# EAGLE design ph_v6 (EAGLE 6.5.0)
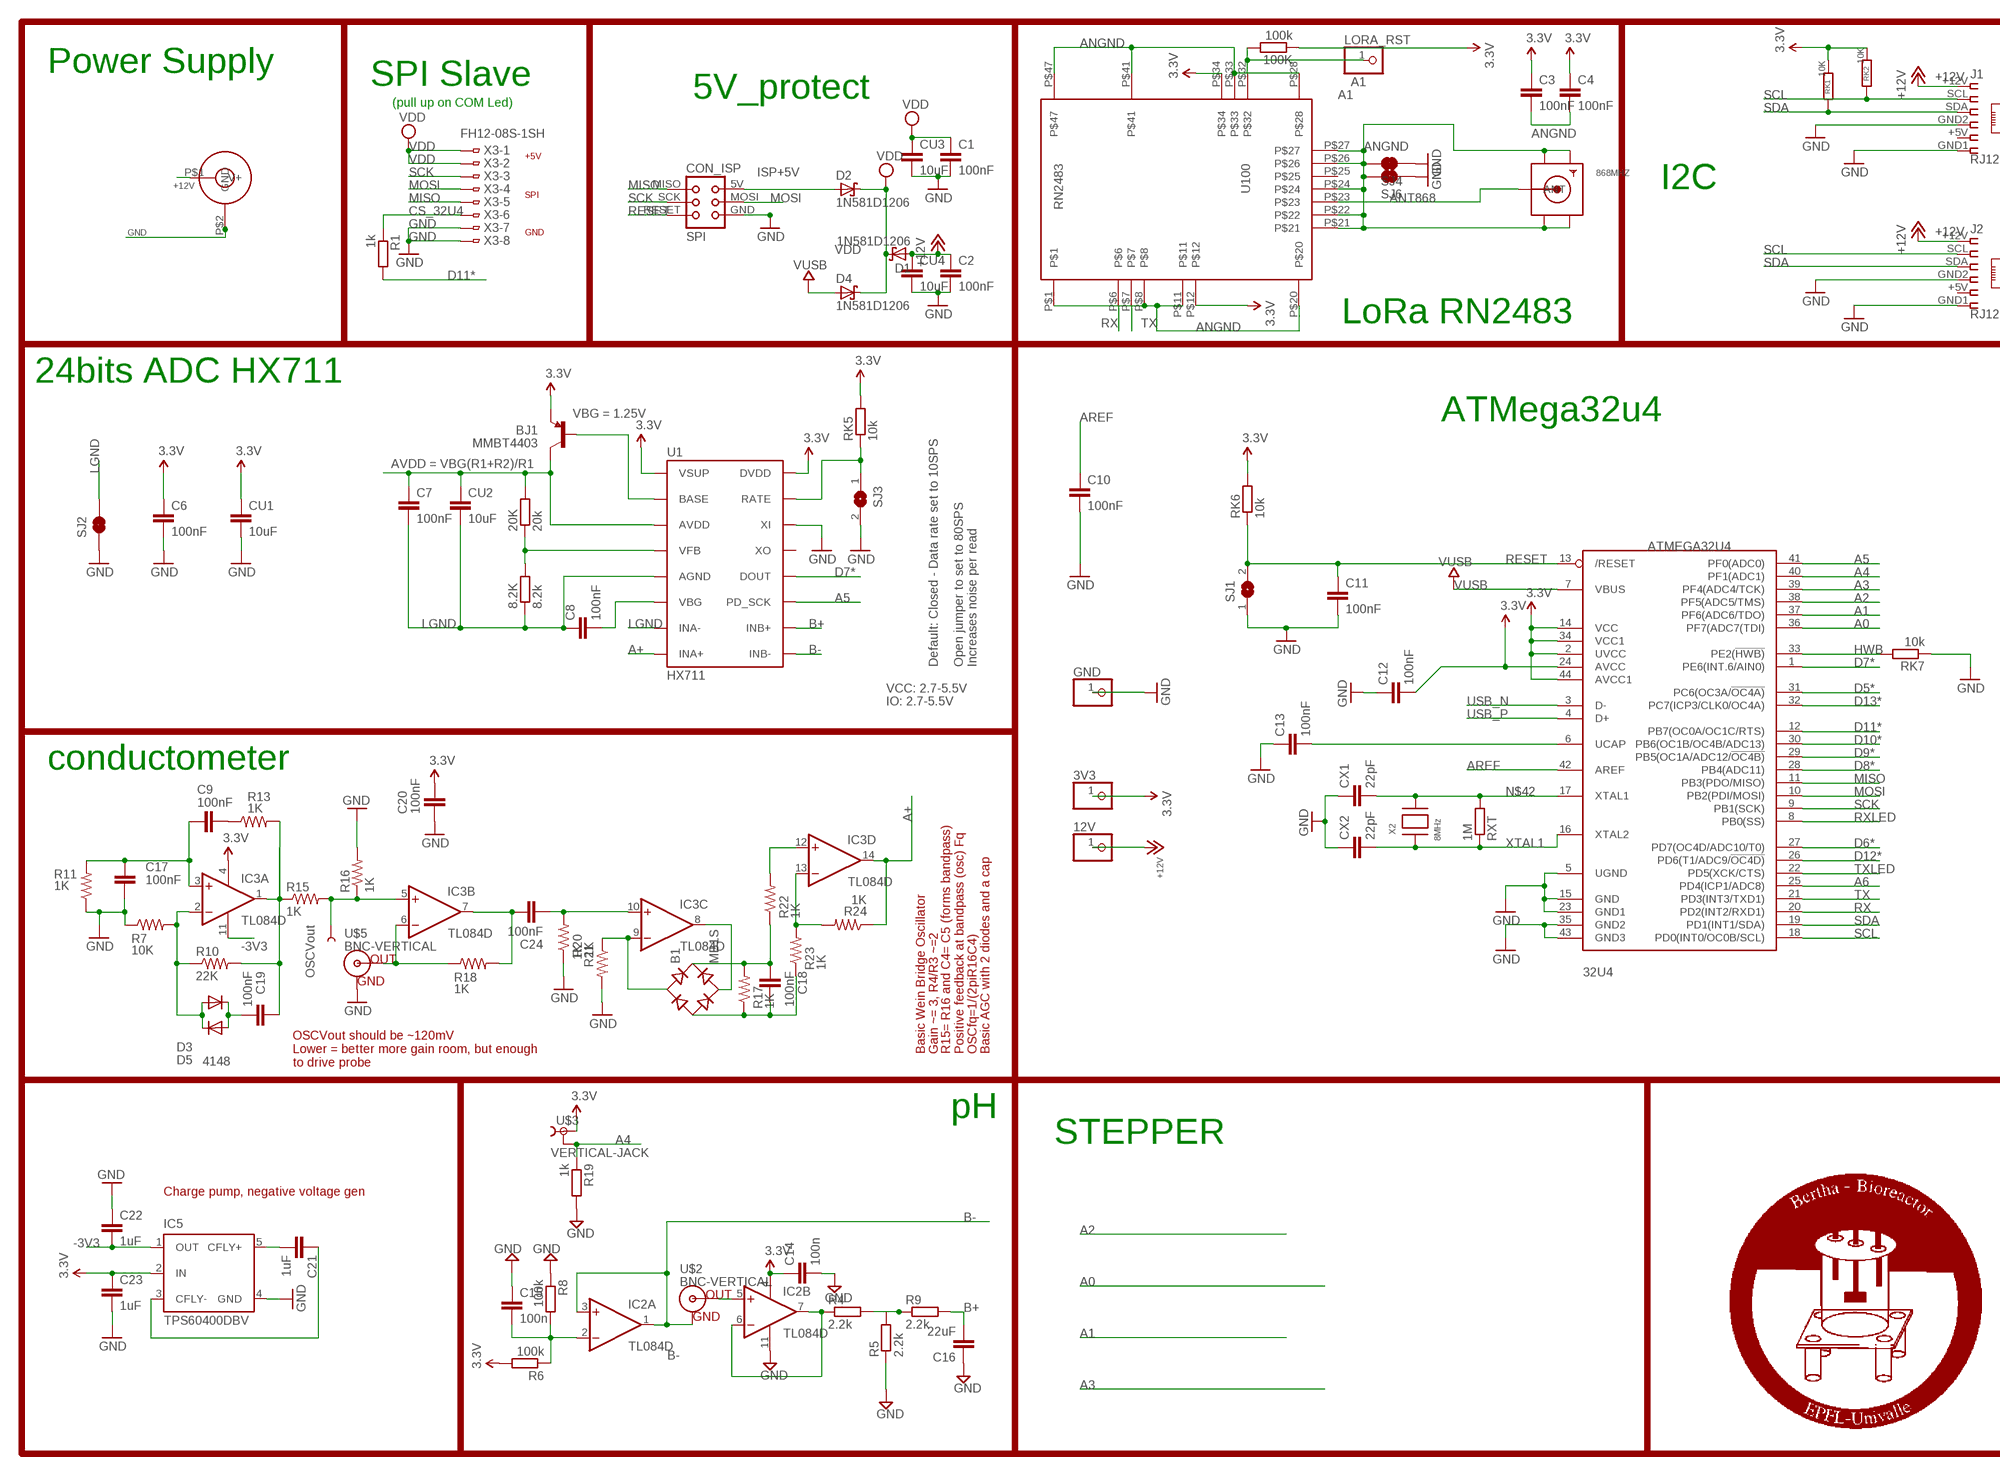
[diagram p0: schematic, sheet 1, part 1 of 2]
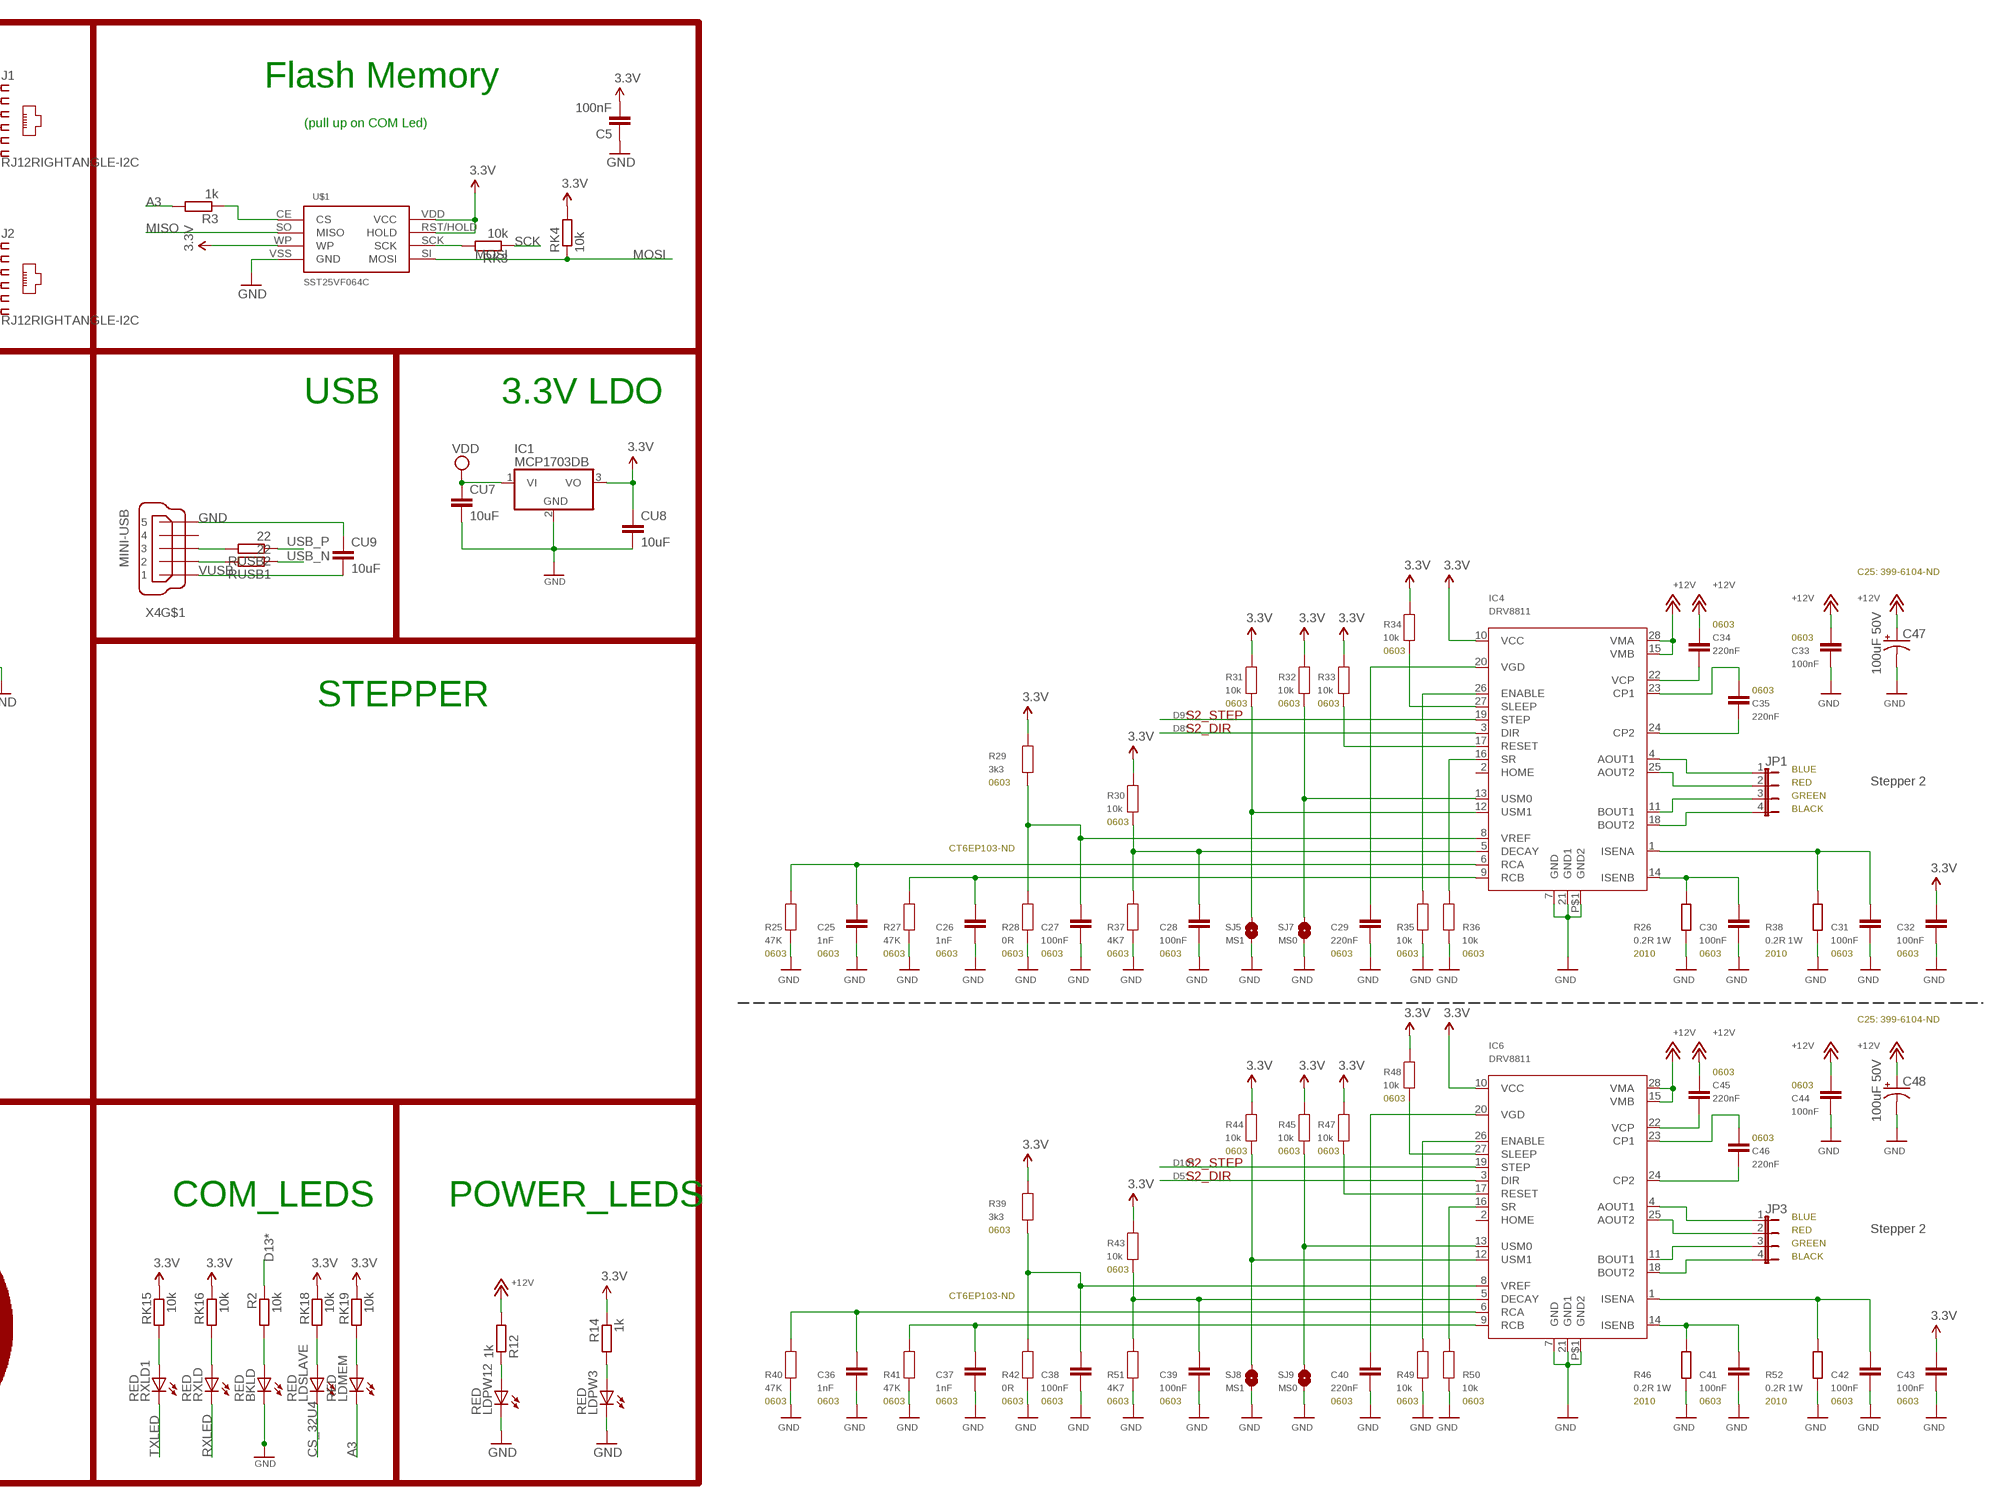
[diagram p1: schematic, sheet 1, part 2 of 2]

## Parts
3V3  PINHD-1X1  [1X01]
8.2K  8.2k  R-EU_R0805  [R0805]
12V  PINHD-1X1  [1X01]
20K  20k  R-EU_R0805  [R0805]
32U4  ATMEGA32U4  ATMEGA32U4-AU  [TQFP44]
100K  100k  R-EU_R0805  [R0805]
868MHZ  SMACONNECTOR_EDGE  [SMA_EDGELAUNCH]
B1  MB1S  [SOIC-4]
BJ1  MMBT4403  TRANSISTOR_PNPMMBT4403  [SOT23-3]
BKLD  RED  LEDCHIP-LED0805  [CHIP-LED0805]
C1  100nF  C-EUC0805  [C0805]
C2  100nF  C-EUC0805  [C0805]
C3  100nF  C-EUC0805  [C0805]
C4  100nF  C-EUC0805  [C0805]
C5  100nF  C-EUC0805  [C0805]
C6  100nF  C-EUC0805  [C0805]
C7  100nF  C-EUC0805  [C0805]
C8  100nF  C-EUC0805  [C0805]
C9  100nF  CAP0805  [0805]
C10  100nF  C-EUC0805  [C0805]
C11  100nF  C-EUC0805  [C0805]
C12  100nF  C-EUC0805  [C0805]
C13  100nF  C-EUC0805  [C0805]
C14  100n  C-EUC0805  [C0805]
C15  100n  C-EUC0805  [C0805]
C16  22uF  C-EUC0805  [C0805]
C17  100nF  CAP0805  [0805]
C18  100nF  CAP0805  [0805]
C19  100nF  CAP0805  [0805]
C20  100nF  CAP0805  [0805]
C21  1uF  CAP0805  [0805]
C22  1uF  CAP0805  [0805]
C23  1uF  CAP0805  [0805]
C24  100nF  CAP0805  [0805]
C25  1nF  CAP0805  [0805]
C26  1nF  CAP0805  [0805]
C27  100nF  CAP0805  [0805]
C28  100nF  CAP0805  [0805]
C29  220nF  CAP0805  [0805]
C30  100nF  CAP0603  [0603]
C31  100nF  CAP0805  [0805]
C32  100nF  CAP0805  [0805]
C33  100nF  CAP0805  [0805]
C34  220nF  CAP0805  [0805]
C35  220nF  CAP0805  [0805]
C36  1nF  CAP0805  [0805]
C37  1nF  CAP0805  [0805]
C38  100nF  CAP0805  [0805]
C39  100nF  CAP0805  [0805]
C40  220nF  CAP0805  [0805]
C41  100nF  CAP0603  [0603]
C42  100nF  CAP0805  [0805]
C43  100nF  CAP0805  [0805]
C44  100nF  CAP0805  [0805]
C45  220nF  CAP0805  [0805]
C46  220nF  CAP0805  [0805]
C47  100uF 50V  CAP_POLE  [PANASONIC_E]
C48  100uF 50V  CAP_POLE  [PANASONIC_E]
CON1  JACK_DC_BARREL  [DC_BARREL]
CON_ISP  SPI  TINYISPT  [TC2030-MCP-NL]
CU1  10uF  C-EUC0805  [C0805]
CU2  10uF  C-EUC0805  [C0805]
CU3  10uF  C-EUC0805  [C0805]
CU4  10uF  C-EUC0805  [C0805]
CU7  10uF  C-EUC0805  [C0805]
CU8  10uF  C-EUC0805  [C0805]
CU9  10uF  C-EUC0805  [C0805]
CX1  22pF  C-EUC0805  [C0805]
CX2  22pF  C-EUC0805  [C0805]
D1  1N581D1206  [LED-1206]
D2  1N581D1206  [LED-1206]
D3  4148  MBR0520LT  [SOD123]
D4  1N581D1206  [LED-1206]
D5  4148  MBR0520LT  [SOD123]
GND  PINHD-1X1  [1X01]
IC1  MCP1703DB  [SOT223]
IC2  TL084D  [SO14]
IC3  TL084D  [SO14]
IC4  DRV8811  [HTSSOP28]
IC5  TPS60400DBV  [SOT23-DBV]
IC6  DRV8811  [HTSSOP28]
J1  RJ12RIGHTANGLE-I2C  [RJ12-RIGHTANGLE-I2C]
J2  RJ12RIGHTANGLE-I2C  [RJ12-RIGHTANGLE-I2C]
JP1  JP4E  [JP4]
JP3  JP4E  [JP4]
LDMEM  RED  LEDCHIP-LED0805  [CHIP-LED0805]
LDPW3  RED  LEDCHIP-LED0805  [CHIP-LED0805]
LDPW12  RED  LEDCHIP-LED0805  [CHIP-LED0805]
LDSLAVE  RED  LEDCHIP-LED0805  [CHIP-LED0805]
LORA_RST  PINHD-1X1  [1X01]
R1  1k  R-EU_R0805  [R0805]
R2  10k  R-EU_R0805  [R0805]
R3  1k  R-EU_R0805  [R0805]
R4  2.2k  R-EU_R0805  [R0805]
R5  2.2k  R-EU_R0805  [R0805]
R6  100k  R-EU_R0805  [R0805]
R7  10K  RESISTOR0805-RES  [0805]
R8  100k  R-EU_R0805  [R0805]
R9  2.2k  R-EU_R0805  [R0805]
R10  22K  RESISTOR0805-RES  [0805]
R11  1K  RESISTOR0805-RES  [0805]
R12  1k  R-EU_R0805  [R0805]
R13  1K  RESISTOR0805-RES  [0805]
R14  1k  R-EU_R0805  [R0805]
R15  1K  RESISTOR0805-RES  [0805]
R16  1K  RESISTOR0805-RES  [0805]
R17  1K  RESISTOR0805-RES  [0805]
R18  1K  RESISTOR0805-RES  [0805]
R19  1k  R-EU_R0805  [R0805]
R20  1K  RESISTOR0805-RES  [0805]
R21  1K  RESISTOR0805-RES  [0805]
R22  1K  RESISTOR0805-RES  [0805]
R23  1K  RESISTOR0805-RES  [0805]
R24  1K  RESISTOR0805-RES  [0805]
R25  47K  RESISTOR0805  [0805]
R26  0.2R 1W  R-EU_R2010  [R2010]
R27  47K  RESISTOR0805  [0805]
R28  0R  RESISTOR0805  [0805]
R29  3k3  RESISTOR0805  [0805]
R30  10k  RESISTOR0805  [0805]
R31  10k  RESISTOR0805  [0805]
R32  10k  RESISTOR0805  [0805]
R33  10k  RESISTOR0805  [0805]
R34  10k  RESISTOR0805  [0805]
R35  10k  RESISTOR0805  [0805]
R36  10k  RESISTOR0805  [0805]
R37  4K7  RESISTOR0805  [0805]
R38  0.2R 1W  R-EU_R2010  [R2010]
R39  3k3  RESISTOR0805  [0805]
R40  47K  RESISTOR0805  [0805]
R41  47K  RESISTOR0805  [0805]
R42  0R  RESISTOR0805  [0805]
R43  10k  RESISTOR0805  [0805]
R44  10k  RESISTOR0805  [0805]
R45  10k  RESISTOR0805  [0805]
R46  0.2R 1W  R-EU_R2010  [R2010]
R47  10k  RESISTOR0805  [0805]
R48  10k  RESISTOR0805  [0805]
R49  10k  RESISTOR0805  [0805]
R50  10k  RESISTOR0805  [0805]
R51  4K7  RESISTOR0805  [0805]
R52  0.2R 1W  R-EU_R2010  [R2010]
RK1  10K  R-EU_M0805  [M0805]
RK2  10K  R-EU_M0805  [M0805]
RK3  10k  R-EU_R0805  [R0805]
RK4  10k  R-EU_R0805  [R0805]
RK5  10k  R-EU_R0805  [R0805]
RK6  10k  R-EU_M0805  [M0805]
RK7  10k  R-EU_M0805  [M0805]
RK15  10k  R-EU_R0805  [R0805]
RK16  10k  R-EU_R0805  [R0805]
RK18  10k  R-EU_R0805  [R0805]
RK19  10k  R-EU_R0805  [R0805]
RUSB1  22  R-EU_M1206  [M1206]
RUSB2  22  R-EU_M1206  [M1206]
RXLD  RED  LEDCHIP-LED0805  [CHIP-LED0805]
RXLD1  RED  LEDCHIP-LED0805  [CHIP-LED0805]
RXT  1M  R-EU_R0805  [R0805]
SJ1  SJ  [SJ]
SJ2  JUMPER-PAD-2-NC_BY_TRACE  [PAD-JUMPER-2-NC_BY_TRACE_YES_SILK]
SJ3  SJ  [SJ]
SJ4  JUMPER-PAD-2-NC_BY_TRACE  [PAD-JUMPER-2-NC_BY_TRACE_YES_SILK]
SJ5  MS1  SJ  [SJ]
SJ6  JUMPER-PAD-2-NC_BY_TRACE  [PAD-JUMPER-2-NC_BY_TRACE_YES_SILK]
SJ7  MS0  SJ  [SJ]
SJ8  MS1  SJ  [SJ]
SJ9  MS0  SJ  [SJ]
TP5  OSCVout  TEST-POINT3  [PAD.03X.03]
U1  HX711  HX711HX711  [SO16]
U100  RN2483  [RN2483]
U$1  SST25VF064C  [SOIC_8-LEAD]
U$2  BNC-VERTICAL  [BNC-VERTICAL]
U$3  VERTICAL-JACK  [VERTICAL-JACK]
U$5  BNC-VERTICAL  [BNC-VERTICAL]
X2  8MHz  XTALNX6035  [NX6035]
X3  FH12-08S-1SH  [FH12-08S-1SH]
X4  MINI-USB  MINI-USB-SCHIELD-32005-201  [32005-201]

## Nets
3.3V [power]: 3V3.1 32U4.2(UVCC) 32U4.14(VCC) 32U4.24(AVCC) 32U4.34(VCC1) 32U4.44(AVCC1) 100K.1 BJ1.2(E) C3.1 C4.1 C5.2 C6.1 C12.2 C14.1 C20.1 C23.1 C32.1 C43.1 CU1.1 CU8.1 IC1.3(VO) IC2.4(P:V+) IC3.4(P:V+) IC4.10(VCC) IC5.2(IN) IC6.10(VCC) R6.2 R14.1 R29.2 R30.2 R31.2 R32.2 R33.2 R34.2 R39.2 R43.2 R44.2 R45.2 R47.2 R48.2 RK1.1 RK2.1 RK4.2 RK5.2 RK6.2 RK15.1 RK16.1 RK18.1 RK19.1 U1.1(VSUP) U1.16(DVDD) U100.P$12 U100.P$34 U$1.RST/HOLD(HOLD) U$1.VDD(VCC) U$1.WP U$3.P$1
+12V [power]: 12V.1 C2.1 C33.1 C34.1 C44.1 C45.1 C47.+ C48.+ CON1.P$1(V+) CU4.1 D1.A IC4.15(VMB) IC4.28(VMA) IC6.15(VMB) IC6.28(VMA) J1.+12V J2.+12V R12.2
-3V3: C22.2 IC3.11(P:V-) IC5.1(OUT)
A0: 32U4.36(PF7(ADC7(TDI))
A1: 32U4.37(PF6(ADC6/TDO)) 100K.2 LORA_RST.1 U100.P$32
A2: 32U4.38(PF5(ADC5/TMS))
A3: 32U4.39(PF4(ADC4/TCK)) LDMEM.C R3.2
A4: 32U4.40(PF1(ADC1)) R19.1 U$3.P$2
A5: 32U4.41(PF0(ADC0)) U1.11(PD_SCK)
A6: 32U4.25(PD4(ICP1/ADC8))
A+: IC3.14(D:OUT) R24.1 U1.8(INA+)
ANGND: 868MHZ.GND@1(GND4) 868MHZ.GND@2(GND3) 868MHZ.GND@3(GND2) 868MHZ.GND@4(GND1) C3.2 C4.2 SJ4.2 SJ6.2 U100.P$1 U100.P$8 U100.P$11 U100.P$20 U100.P$21 U100.P$22 U100.P$24 U100.P$26 U100.P$27 U100.P$28 U100.P$33 U100.P$41 U100.P$47
ANT868: 868MHZ.P(ANT) U100.P$23
AREF: 32U4.42(AREF) C10.1
B+: C16.2 R9.2 U1.10(INB+)
B-: IC2.1(A:OUT) IC2.3(A:+IN) U1.9(INB-) U$2.G(GND)
CN3: C8.2 U1.6(VBG)
CS_32U4: LDSLAVE.C R1.1 X3.6
D5*: 32U4.31(PC6(OC3A/!OC4A)) IC6.3(DIR)
D6*: 32U4.27(PD7(OC4D/ADC10/T0))
D7*: 32U4.1(PE6(INT.6/AIN0)) U1.12(DOUT)
D8*: 32U4.28(PB4(ADC11)) IC4.3(DIR)
D9*: 32U4.29(PB5(OC1A/ADC12/!OC4B)) IC4.19(STEP)
D10*: 32U4.30(PB6(OC1B/OC4B/ADC13)) IC6.19(STEP)
D11*: 32U4.12(PB7(OC0A/OC1C/RTS)) R1.2
D12*: 32U4.26(PD6(T1/ADC9/!OC4D))
D13*: 32U4.32(PC7(ICP3/CLK0/OC4A)) R2.1
GND [power]: 32U4.5(UGND) 32U4.15(GND) 32U4.23(GND1) 32U4.35(GND2) 32U4.43(GND3) BKLD.C C1.2 C2.2 C5.1 C6.2 C10.2 C11.2 C12.1 C13.1 C14.2 C15.1 C16.1 C17.1 C20.2 C22.1 C23.2 C25.2 C26.2 C27.2 C28.2 C29.2 C30.2 C31.2 C32.2 C33.2 C36.2 C37.2 C38.2 C39.2 C40.2 C41.2 C42.2 C43.2 C44.2 C47.- C48.- CON1.P$2(GND) CON_ISP.GND CU1.2 CU3.2 CU4.2 CU7.2 CU8.2 CU9.1 CX1.1 CX2.1 GND.1 IC1.2(GND) IC2.11(P:V-) IC4.7(GND) IC4.21(GND1) IC4.P$1(GND2) IC5.4(GND) IC6.7(GND) IC6.21(GND1) IC6.P$1(GND2) J1.GND1 J1.GND2 J2.GND1 J2.GND2 LDPW3.C LDPW12.C R5.1 R7.1 R8.1 R11.1 R16.2 R19.2 R20.1 R21.2 R25.1 R26.1 R27.1 R28.1 R35.1 R36.1 R37.1 R38.1 R40.1 R41.1 R42.1 R46.1 R49.1 R50.1 R51.1 R52.1 RK7.1 SJ1.1 SJ2.1 SJ3.2 SJ4.1 SJ5.1 SJ6.1 SJ7.1 SJ8.1 SJ9.1 U1.14(XI) U$1.VSS(GND) U$5.G(GND) X3.7 X3.8 X4.5
HWB: 32U4.33(PE2(!HWB)) RK7.2
ISP+5V: CON_ISP.5V(VCC) D2.A
LGND: 8.2K.1 C7.2 C8.1 CU2.2 SJ2.2 U1.5(AGND) U1.7(INA-)
MISO: 32U4.11(PB3(PDO/MISO)) CON_ISP.MISO U$1.SO(MISO) X3.5
MOSI: 32U4.10(PB2(PDI/MOSI)) CON_ISP.MOSI RK4.1 U$1.SI(MOSI) X3.4
N$1: 32U4.6(UCAP) C13.2
N$2: IC4.18(BOUT2) JP1.4
N$3: BKLD.A R2.2
N$4: IC4.25(AOUT2) JP1.2
N$5: 20K.2 BJ1.3(C) C7.1 CU2.1 U1.3(AVDD)
N$6: C35.2 IC4.24(CP2)
N$7: LDPW12.A R12.1
N$8: C35.1 IC4.23(CP1)
N$9: C34.2 IC4.22(VCP)
N$10: R3.1 U$1.CE(CS)
N$11: C29.1 IC4.20(VGD)
N$12: C31.1 IC4.1(ISENA) R38.2
N$13: C30.1 IC4.14(ISENB) R26.2
N$14: C28.1 IC4.5(DECAY) R30.1 R37.2
N$15: C25.1 IC4.6(RCA) R25.2
N$16: C26.1 IC4.9(RCB) R27.2
N$17: R4.2 R5.2 R9.1
N$18: D3.A D5.C IC3.2(A:-IN) R7.2 R10.1
N$19: IC4.27(SLEEP) R34.1
N$20: C9.1 R13.1
N$21: IC2.5(B:+IN) U$2.S(OUT)
N$22: LDSLAVE.A RK18.2
N$23: RK3.2 U$1.SCK
N$24: RK16.2 RXLD.A
N$25: LDMEM.A RK19.2
N$26: C19.1 IC3.1(A:OUT) R10.2 R13.2 R15.1
N$27: C15.2 IC2.2(A:-IN) R6.1 R8.2
N$28: IC2.6(B:-IN) IC2.7(B:OUT) R4.1
N$29: IC3.5(B:+IN) R15.2 R16.1 TP5.P$1
N$30: C9.2 C17.2 IC3.3(A:+IN) R11.2
N$31: IC4.17(RESET) R33.1
N$32: C27.1 IC4.8(VREF) R28.2 R29.1
N$33: IC4.26(ENABLE) R35.2
N$34: LDPW3.A R14.2
N$35: IC3.6(B:-IN) R18.1 U$5.S(OUT)
N$36: C24.1 IC3.7(B:OUT) R18.2
N$37: IC4.12(USM1) R31.1 SJ5.2
N$38: BJ1.1(B) U1.2(BASE)
N$39: 8.2K.2 20K.1 U1.4(VFB)
N$40: C24.2 IC3.10(C:+IN) R20.2
N$41: RK5.1 SJ3.1 U1.15(RATE)
N$42: 32U4.17(XTAL1) CX1.2 RXT.2 X2.P$2
N$43: B1.~2(AC2) IC3.8(C:OUT)
N$44: C19.2 D3.C D5.A
N$45: C21.1 IC5.3(CFLY-)
N$46: C21.2 IC5.5(CFLY+)
N$47: B1.- C18.1 R17.1 R23.1
N$48: B1.~1(AC1) IC3.9(C:-IN) R21.1
N$49: B1.+ C18.2 R17.2 R22.1
N$50: IC3.12(D:+IN) R22.2
N$51: IC3.13(D:-IN) R23.2 R24.2
N$52: RK15.2 RXLD1.A
N$53: IC4.13(USM0) R32.1 SJ7.2
N$54: IC4.16(SR) R36.2
N$55: IC4.4(AOUT1) JP1.1
N$56: IC4.11(BOUT1) JP1.3
N$73: IC6.18(BOUT2) JP3.4
N$74: IC6.25(AOUT2) JP3.2
N$75: C46.2 IC6.24(CP2)
N$76: C46.1 IC6.23(CP1)
N$77: C45.2 IC6.22(VCP)
N$78: C40.1 IC6.20(VGD)
N$79: C42.1 IC6.1(ISENA) R52.2
N$80: C41.1 IC6.14(ISENB) R46.2
N$81: C39.1 IC6.5(DECAY) R43.1 R51.2
N$82: C36.1 IC6.6(RCA) R40.2
N$83: C37.1 IC6.9(RCB) R41.2
N$84: IC6.27(SLEEP) R48.1
N$85: IC6.17(RESET) R47.1
N$86: C38.1 IC6.8(VREF) R39.1 R42.2
N$87: IC6.26(ENABLE) R49.2
N$88: IC6.12(USM1) R44.1 SJ8.2
N$89: IC6.13(USM0) R45.1 SJ9.2
N$90: IC6.16(SR) R50.2
N$95: IC6.4(AOUT1) JP3.1
N$96: IC6.11(BOUT1) JP3.3
RESET: 32U4.13(/RESET) C11.1 CON_ISP.RESET RK6.1 SJ1.2
RX: 32U4.20(PD2(INT2/RXD1)) U100.P$6
RXLED: 32U4.8(PB0(SS)) RXLD.C
SCK: 32U4.9(PB1(SCK)) CON_ISP.SCK RK3.1 X3.3
SCL: 32U4.18(PD0(INT0/OC0B/SCL)) J1.SCL J2.SCL RK2.2
SDA: 32U4.19(PD1(INT1/SDA)) J1.SDA J2.SDA RK1.2
TX: 32U4.21(PD3(INT3/TXD1)) U100.P$7
TXLED: 32U4.22(PD5(XCK/CTS)) RXLD1.C
USB_N: 32U4.3(D-) RUSB1.1
USB_P: 32U4.4(D+) RUSB2.1
USBC_N: RUSB1.2 X4.2
USBC_P: RUSB2.2 X4.3
VDD [power]: C1.1 CU3.1 CU7.1 D1.C D2.C D4.C IC1.1(VI) X3.1 X3.2
VUSB: 32U4.7(VBUS) CU9.2 D4.A X4.1
XTAL1: 32U4.16(XTAL2) CX2.2 RXT.1 X2.P$1
Unconnected: IC2.8(C:OUT) IC2.9(C:-IN) IC2.10(C:+IN) IC2.12(D:+IN) IC2.13(D:-IN) IC2.14(D:OUT) IC4.2(HOME) IC6.2(HOME) J1.+5V J2.+5V U1.13(XO) U100.P$25 X4.4 X4.M1(S:S1) X4.M2(S:S2) X4.M3(S:S3) X4.M4(S:S4)

## Notes on the sheet
- Power Supply
- SPI Slave | Flash Memory
- 5V_protect
- (pull up on COM Led)
- (pull up on COM Led)
- +5V
- I2C
- SPI
- GND
- LoRa RN2483
- 24bits ADC HX711
- USB | 3.3V LDO
- VBG = 1.25V
- ATMega32u4
- AVDD = VBG(R1+R2)/R1
- C25: 399-6104-ND
- 0603
- 0603
- 0603
- Default: Closed - Data rate set to 10SPS
- Open jumper to set to 80SPS
  Increases noise per read
- 0603
- VCC: 2.7-5.5V | STEPPER | 0603 | 0603 | 0603
- IO: 2.7-5.5V | S2_STEP
- S2_DIR
- BLUE
- conductometer | 0603 | RED | Stepper 2
- GREEN
- BLACK
- 0603
- CT6EP103-ND
- 0603 | 0603 | 0603 | 0603 | 0603 | 0603 | 0603 | 0603 | 0603 | 0603 | 0603 | 2010 | 0603 | 2010 | 0603 | 0603
- C25: 399-6104-ND
- Basic Wein Bridge Oscillator | Gain ~= 3, R4/R3 ~=2
- R15= R16 and C4= C5 (forms bandpass)
  Positive feedback at bandpass (osc) Fq
- OSCfq=1/(2piR16C4) | Basic AGC with 2 diodes and a cap | 0603
- OSCVout should be ~120mV
  Lower = better more gain room, but enough
  to drive probe
- 0603
- 0603
- pH | 0603
- 0603 | 0603 | 0603
- STEPPER | S2_STEP
- S2_DIR
- COM_LEDS | POWER_LEDS
- Charge pump, negative voltage gen | BLUE
- 0603 | RED | Stepper 2
- GREEN
- BLACK
- 0603
- CT6EP103-ND
- 0603 | 0603 | 0603 | 0603 | 0603 | 0603 | 0603 | 0603 | 0603 | 0603 | 0603 | 2010 | 0603 | 2010 | 0603 | 0603

## Library data of the parts
3V3 12V GND LORA_RST = Headerlibrary:PINHD-1X1: PIN HEADER
8.2K 20K R4-R6 R8 R9 R14 R19 RK1 RK2 RK5-RK7 RUSB1 RUSB2 = resistor:R-EU_: RESISTOR, European symbol
32U4 = adafruit:ATMEGA32U4: http://www.ladyada.net/library/eagle
100K R1-R3 R12 R26 R38 R46 R52 RK3 RK4 RK15 RK16 RK18 RK19 RXT = rcl:R-EU_: RESISTOR, European symbol
868MHZ = sma_end_launch:SMACONNECTOR: SMA Connector 90° DIP SMA Connector, 50 Ohm (4UConnector: 07259)
B1 = rectifier:MB*S: Bridge Rectifier Source: http://www.fairchildsemi.com/ds/MB/MB6S.pdf
BJ1 = SparkFun-DiscreteSemi:TRANSISTOR_PNP: Generic PNP BJT Double check pinouts against datasheets- not all devices are the same! MMBT3906 - 40V 200mA SOT-23 (TRANS-08052) MMBT4403 - 40V 600mA SOT-23 (TRANS-09245); PROD_ID: TRANS-09245
BKLD LDMEM LDPW3 LDPW12 LDSLAVE RXLD RXLD1 = adafruit:LED: LED OSRAM: - CHIPLED LG R971, LG N971, LY N971, LG Q971, LY Q971, LO R971, LY R971 LH N974, LH R974 LS Q976, LO Q976, LY Q976 LO Q996 - Hyper CHIPLED LW Q18S LB Q993, LB Q99A, LB R99A - SideLED LS A670, LO A670, LY A670, LG A670, LP A670 LB A673, LV A673, LT A673, LW A673 LH A674 LY A675 LS A676, LA A676, LO A676, LY A676, LW A676 LS A679, LY A679, LG A679 - Hyper Micro SIDELED® LS Y876, LA Y876, LO Y876, LY Y876 LT Y87S - SmartLED LW L88C, LW L88S LB L89C, LB L89S, LG L890 LS L89K, LO L89K, LY L89K LS L896, LA L896, LO L896, LY L896 - TOPLED LS T670, LO T670, LY T670, LG T670, LP T670 LSG T670, LSP T670, LSY T670, LOP T670, LYG T670 LG T671, LOG T671, LSG T671 LB T673, LV T673, LT T673, LW T673 LH T674 LS T676, LA T676, LO T676, LY T676, LB T676, LH T676, LSB T676, LW T676 LB T67C, LV T67C, LT T67C, LS T67K, LO T67K, LY T67K, LW E67C LS E67B, LA E67B, LO E67B, LY E67B, LB E67C, LV E67C, LT E67C LW T67C LS T679, LY T679, LG T679 LS T770, LO T770, LY T770, LG T770, LP T770 LB T773, LV T773, LT T773, LW T773 LH T774 LS E675, LA E675, LY E675, LS T675 LS T776, LA T776, LO T776, LY T776, LB T776 LHGB T686 LT T68C, LB T68C - Hyper Mini TOPLED® LB M676 - Mini TOPLED Santana® LG M470 LS M47K, LO M47K, LY M47K Source: http://www.osram.convergy.de/
C1-C8 C10-C16 CU1-CU4 CU7-CU9 CX1 CX2 = rcl:C-EU: CAPACITOR, European symbol
C9 C17-C24 = SparkysWidgets:CAP: Capacitor Standard 0603 ceramic capacitor, and 0.1" leaded capacitor.
C25-C46 = freetronics-master-v1:CAP: Capacitor Standard 0603 ceramic capacitor, and 0.1" leaded capacitor.
C47 C48 = freetronics-original:CAP_POL: Capacitor Polarized These are standard SMD and PTH capacitors. Normally 10uF, 47uF, and 100uF in electrolytic and tantalum varieties. Always verify the external diameter of the through hole cap, it varies with capacity, voltage, and manufacturer. The EIA devices should be standard.
CON1 = lpatiny:JACK_DC_BARREL
CON_ISP = lpatiny:TINYISP: CONNECTOR
D1 D2 D4 = lpatiny:1N581*: 1.0A SCHOTTKY BARRIER RECTIFIER Source: http://www.diodes.com/datasheets/ds23001.pdf
D3 D5 = SparkysWidgets:MBR0520LT: SCHOTTKY BARRIER RECTIFIER Source: http://onsemi.com .. MBR0520LT1-D.pdf
IC1 = linear:MCP1703: 250 mA, 16V, Low Quiescent Current LDO Regulator Source: http://ww1.microchip.com/downloads/en/DeviceDoc/22049b.pdf
IC2 IC3 = linear:TL084: OP AMP
IC4 IC6 = eje-components:DRV8811
IC5 = SparkysWidgets:TPS60400DBV: UNREGULATED CHARGE PUMP VOLTAGE INVERTER 60-mA unregultated charge pump voltage inverter Source: http://focus.ti.com/lit/ds/symlink/tps6040i.pdf
J1 J2 = lpatiny:RJ12: CORCOM Modular RJ Jacks No Shield Source: www.tycoelectronics.com .. ENG_DS_1654001_1099_RJ_L_0507.pdf
JP1 JP3 = jumper:JP4E: JUMPER
R7 R10 R11 R13 R15-R18 R20-R24 = SparkysWidgets:RESISTOR: Resistor
R25 R27-R37 R39-R45 R47-R51 = freetronics-master-v1:RESISTOR: Resistor
SJ1 SJ3 = jumper:SJ: SMD solder JUMPER
SJ2 SJ4 SJ6 = SparkFun-Passives:JUMPER-PAD-2-NC_BY_TRACE
SJ5 SJ7-SJ9 = freetronics-luke:SJ: PCB "solder jumper". Note that there should nothing on the BOM corresponding to this "component".
TP5 = SW_Passives:TEST-POINT: Bare copper test points for troubleshooting or ICT
U1 = Testing:HX711; PROD_ID: IC-12445
U100 = Octanis1:RN2483: Microchip Low-Power Long Range LoRaTM Technology Transceiver Module
U$1 = BertaLib:SST25VF064C
U$2 U$5 = phMeter:BNC-VERTICAL
U$3 = phMeter:VERTICAL-JACK
X2 = lpatiny:XTAL: Low cost SMT crystals, no capacitors included http://www.ladyada.net/library/eagle
X3 = con-hirose:FH12-08S-1S: 1mm Pitch Connectors For FPC/FFC Source: Data sheet <http://www.hirose.co.jp/cataloge_hp/e58605370.pdf>; OC_FARNELL: unknown; OC_NEWARK: unknown
X4 = con-cypressindustries:MINI-USB-SCHIELD-: MINI USB-B Conector Source: www.cypressindustries.com; OC_FARNELL: unknown; OC_NEWARK: unknown

## Net classes
0 default: width 0.203 mm, clearance 0.25 mm
1 power: width 0.203 mm, drill 0.305 mm, clearance 0.25 mm
2 VIN: width 0.457 mm, clearance 0.25 mm
3 fine: width 0.254 mm, clearance 0.25 mm
4 aref: width 0.356 mm, clearance 0.25 mm

## Board
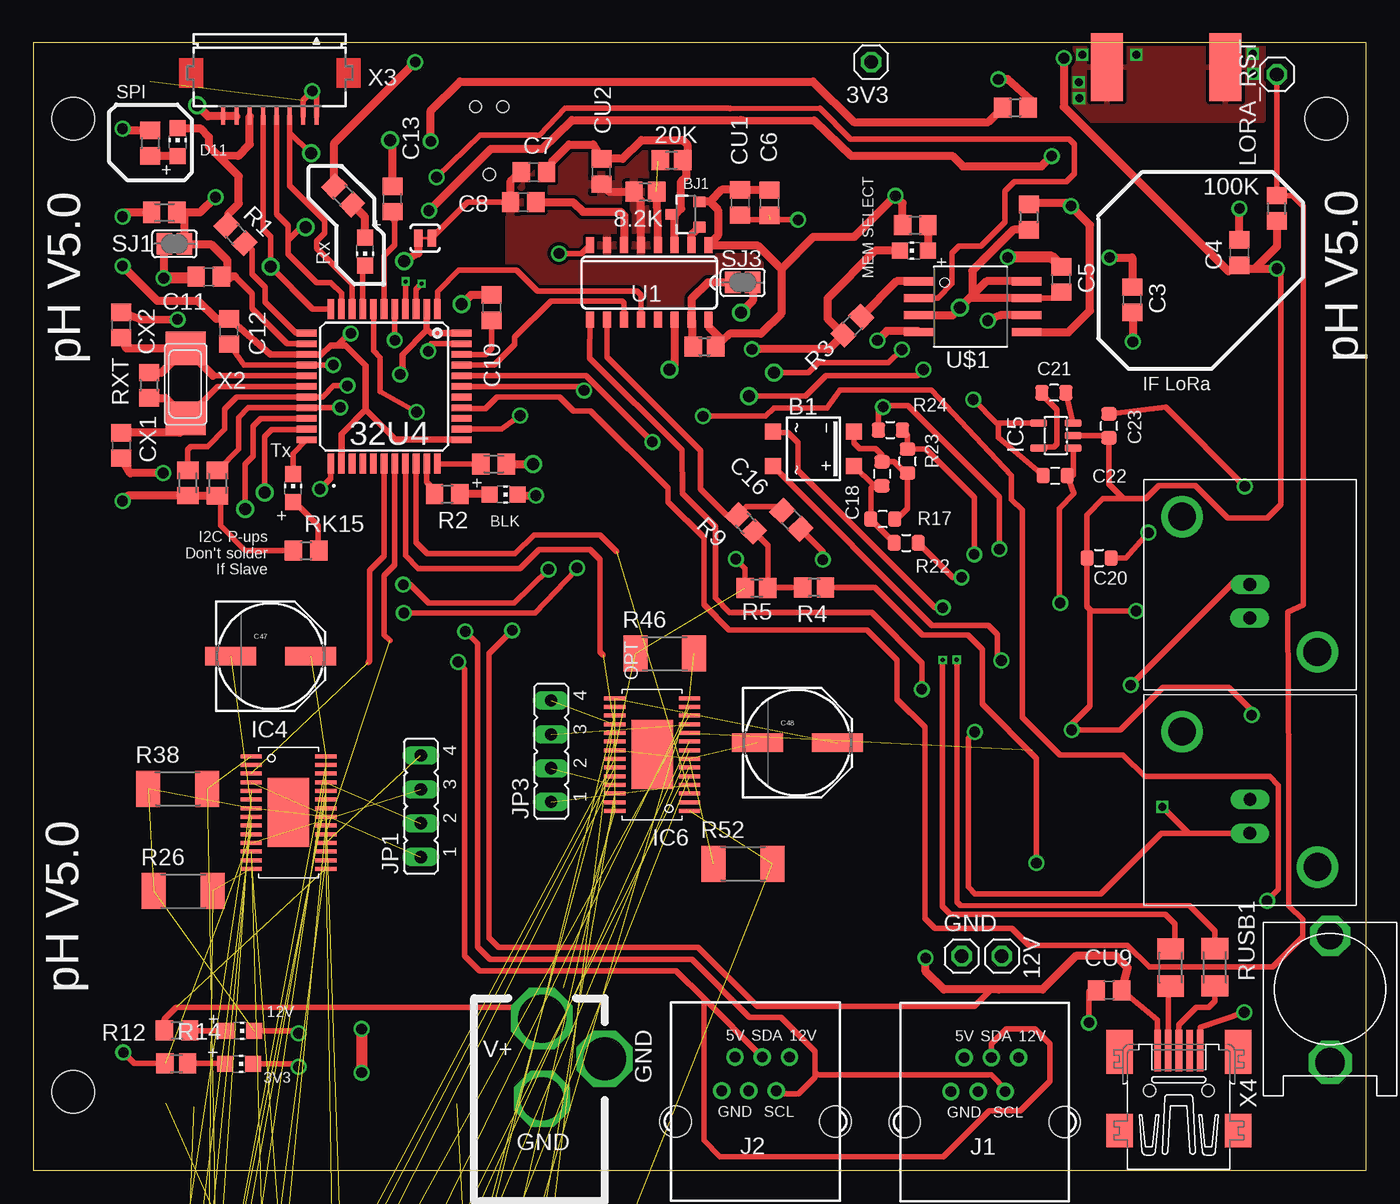
[diagram p2: board, top side]
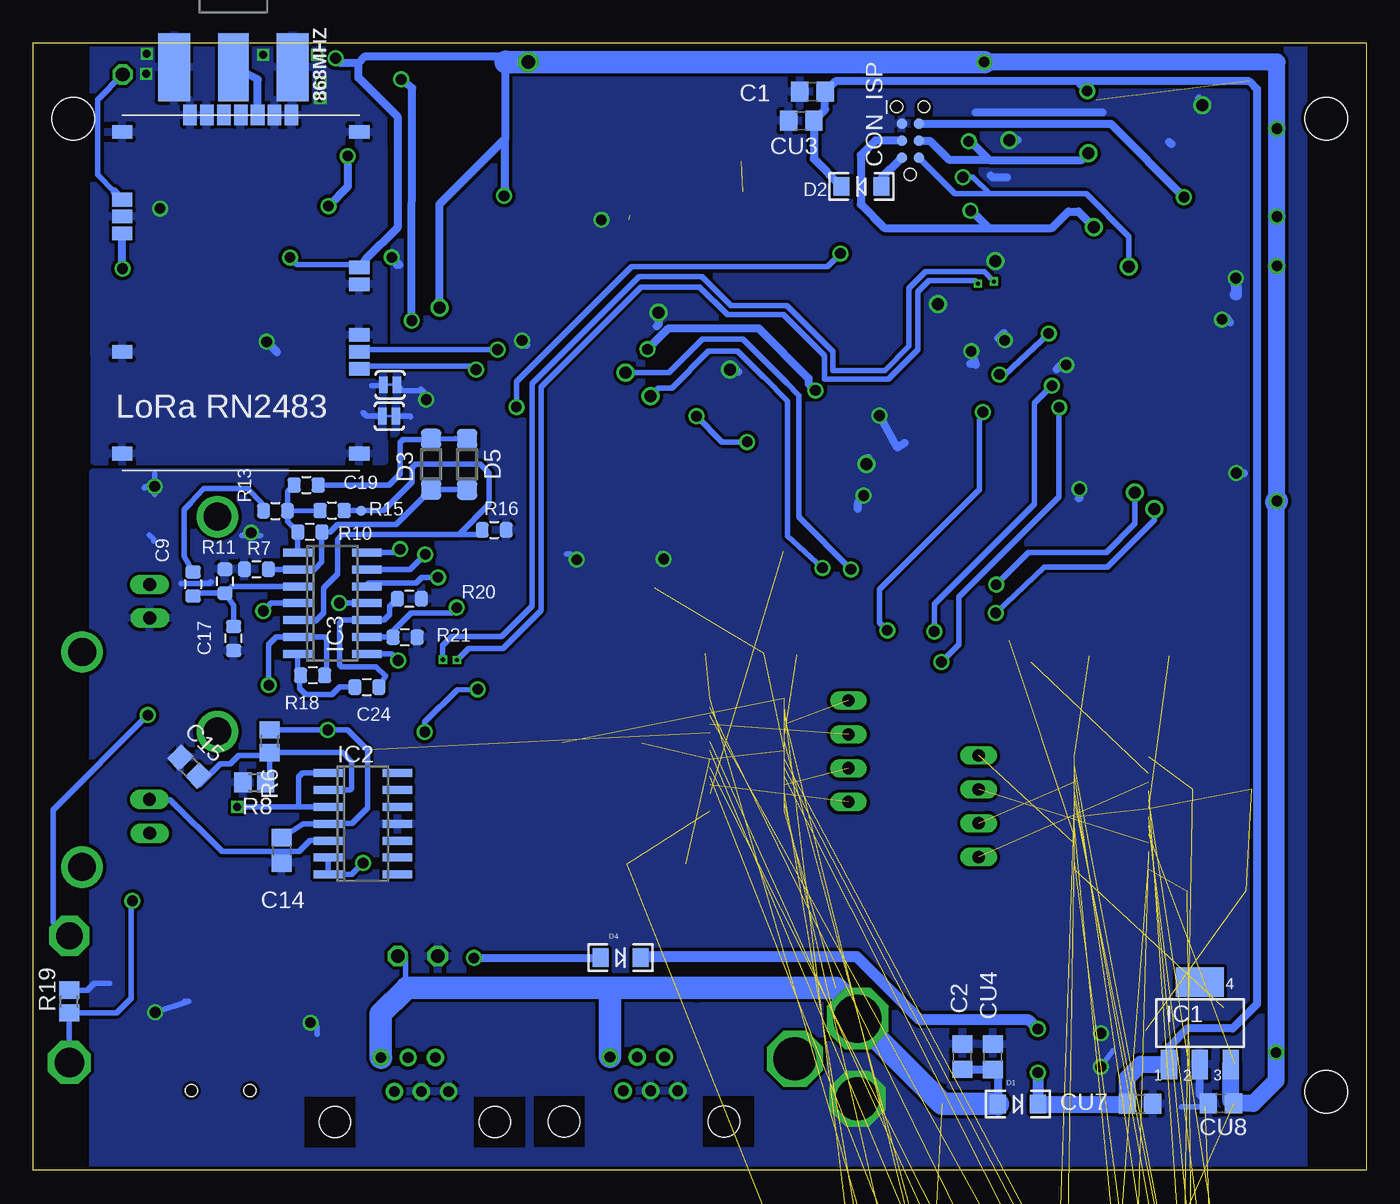
[diagram p3: board, bottom side, seen from below]

Size 100 x 84.6 mm. Coordinates in mm from the lower left corner, seen from the top.
Outline: 0,0 100,0 100,84.6 0,84.6 0,0
Copper layers (1*2*15*16): Top 0.035mm / dielectric 0.2mm / layer 2 0.0175mm / dielectric 1.1mm / layer 15 0.0175mm / dielectric 0.2mm / Bottom 0.035mm
Design rules "SeeedStudio_DRU_no_angle_20130527": minimum track width 6mil, minimum drill 12mil, track to track 6mil, track to pad 6mil, pad to pad 6mil, via to via 6mil, smd to smd 0mil, copper to edge 10mil, drill to drill 10mil, minimum pad ring 6mil, minimum via ring 6mil, stop-mask expansion 2mil, vias tented up to drill 25mil, thermal gap 10mil
Holes 3.2 mm at 3,78.9 97,78.9 3,5.9
vRestrict: area 13.7,78 to 21.9,81.8

### Footprints (pad centres in the part's own frame; a part is rotated, then mirrored left to right if it is on the bottom)
1X01 = drill 1.016 octagon: 1 0,0
R0805 = smd 1.3 x 1.5: 1 -0.85,0; 2 0.85,0
TQFP44 = smd 1.5 x 0.5: 1 -5.8,4; 2 -5.8,3.2; 3 -5.8,2.4; 4 -5.8,1.6; 5 -5.8,0.8; 6 -5.8,0; 7 -5.8,-0.8; 8 -5.8,-1.6; 9 -5.8,-2.4; 10 -5.8,-3.2; 11 -5.8,-4; 23 5.8,-4; 24 5.8,-3.2; 25 5.8,-2.4; 26 5.8,-1.6; 27 5.8,-0.8; 28 5.8,0; 29 5.8,0.8; 30 5.8,1.6; 31 5.8,2.4; 32 5.8,3.2; 33 5.8,4 | smd 0.5 x 1.5: 12 -4,-5.8; 13 -3.2,-5.8; 14 -2.4,-5.8; 15 -1.6,-5.8; 16 -0.8,-5.8; 17 0,-5.8; 18 0.8,-5.8; 19 1.6,-5.8; 20 2.4,-5.8; 21 3.2,-5.8; 22 4,-5.8; 34 4,5.8; 35 3.2,5.8; 36 2.4,5.8; 37 1.6,5.8; 38 0.8,5.8; 39 0,5.8; 40 -0.8,5.8; 41 -1.6,5.8; 42 -2.4,5.8; 43 -3.2,5.8; 44 -4,5.8
R0805' = smd 1.3 x 1.5: 1 -0.95,0; 2 0.95,0
SMA_EDGELAUNCH = smd 5.08 x 2.413: GND@1 2.54,-4.445; GND@2 2.54,4.445 | smd 5.08 x 2.413 bottom: GND@3 2.54,4.445; GND@4 2.54,-4.445 | smd 5.08 x 2.286: P 2.54,0
SOIC-4 = smd 1.2 x 1.2: + 1.3,3.05; - -1.3,3.05; ~1 -1.3,-3.05; ~2 1.3,-3.05
SOT23-3 = smd 0.8 x 0.9: 1 -0.95,-1; 2 0.95,-1; 3 0,1.1
CHIP-LED0805 = smd 1.2 x 1.2: A 0,-1.05; C 0,1.05
C0805 = smd 1.3 x 1.5: 1 -0.95,0; 2 0.95,0
0805 = smd 0.984 x 1.143: 1 -0.9,0; 2 0.9,0
0805' = smd 0.8 x 1.2: 1 -0.9,0; 2 0.9,0
0603 = smd 0.762 x 0.762: 1 -0.762,0; 2 0.762,0
PANASONIC_E = smd 3.8 x 1.4: + 3,0; - -3,0
DC_BARREL = drill 3.6 pad 4.5 octagon: P$1 0,13.7 | drill 3.2 pad 4.064 octagon: P$2 0,7.7; P$3 4.7,10.7
TC2030-MCP-NL = smd 0.787 x 0.787: 5V 1.27,0.635; GND 3.81,0.635; MISO 1.27,-0.635; MOSI 2.54,0.635; RESET 3.81,-0.635; SCK 2.54,-0.635 | hole 0.889: 0,0; 5.08,-1.016; 5.08,1.016
LED-1206 = smd 1.2 x 1.4: A -1.5,0; C 1.5,0
SOD123 = smd 1.524 x 1.524: A 1.9,0; C -1.9,0
SOT223 = smd 1.219 x 2.235: 1 -2.311,-3.099; 2 0,-3.099; 3 2.311,-3.099 | smd 3.6 x 2.2: 4 0,3.099
SO14 = smd 0.6 x 2.2: 1 -3.81,-2.6; 2 -2.54,-2.6; 3 -1.27,-2.6; 4 0,-2.6; 5 1.27,-2.6; 6 2.54,-2.6; 7 3.81,-2.6; 8 3.81,2.6; 9 2.54,2.6; 10 1.27,2.6; 11 0,2.6; 12 -1.27,2.6; 13 -2.54,2.6; 14 -3.81,2.6
HTSSOP28 = smd 0.3 x 1.6: 1 -4.225,-2.8; 2 -3.575,-2.8; 3 -2.925,-2.8; 4 -2.275,-2.8; 5 -1.625,-2.8; 6 -0.975,-2.8; 7 -0.325,-2.8; 8 0.325,-2.8; 9 0.975,-2.8; 10 1.625,-2.8; 11 2.275,-2.8; 12 2.925,-2.8; 13 3.575,-2.8; 14 4.225,-2.8; 15 4.225,2.8; 16 3.575,2.8; 17 2.925,2.8; 18 2.275,2.8; 19 1.625,2.8; 20 0.975,2.8; 21 0.325,2.8; 22 -0.325,2.8; 23 -0.975,2.8; 24 -1.625,2.8; 25 -2.275,2.8; 26 -2.925,2.8; 27 -3.575,2.8; 28 -4.225,2.8 | smd 5.18 x 3.1: P$1 0,0
SOT23-DBV = smd 0.55 x 1.27: 1 -0.95,-1.3; 2 0,-1.3; 3 0.95,-1.3; 4 0.95,1.3; 5 -0.95,1.3
RJ12-RIGHTANGLE-I2C = drill 0.8 pad 1.3: +5V -1.54,4.84; +12V 2.54,4.84; GND1 -2.54,2.3; GND2 -0.5,2.3; SCL 1.54,2.3; SDA 0.5,4.84 | hole 2.36: -6,0; 6,0
JP4 = drill 0.914 long: 1 -3.81,0; 2 -1.27,0; 3 1.27,0; 4 3.81,0
R2010 = smd 1.8 x 2.7: 1 -2.2,0; 2 2.2,0
M0805 = smd 1.3 x 1.6: 1 -0.95,0; 2 0.95,0
M1206 = smd 1.6 x 2: 1 -1.4,0; 2 1.4,0
SJ = smd 1.168 x 1.6: 1 -0.762,0; 2 0.762,0
PAD-JUMPER-2-NC_BY_TRACE_YES_SILK = smd 0.635 x 1.27: 1 -0.508,0; 2 0.508,0
PAD.03X.03 = smd 0.762 x 0.762: P$1 0,0
SO16 = smd 0.6 x 1.2: 1 -4.445,-2.8; 2 -3.175,-2.8; 3 -1.905,-2.8; 4 -0.635,-2.8; 5 0.635,-2.8; 6 1.905,-2.8; 7 3.175,-2.8; 8 4.445,-2.8; 9 4.445,2.8; 10 3.175,2.8; 11 1.905,2.8; 12 0.635,2.8; 13 -0.635,2.8; 14 -1.905,2.8; 15 -3.175,2.8; 16 -4.445,2.8
RN2483 = smd 1.524 x 1.016: P$1 17.78,1.27; P$6 17.78,7.62; P$7 17.78,8.89; P$8 17.78,10.16; P$11 17.78,13.97; P$12 17.78,15.24; P$20 17.78,25.4; P$28 0,25.4; P$32 0,20.32; P$33 0,19.05; P$34 0,17.78; P$41 0,8.89; P$47 0,1.27 | smd 1.016 x 1.524: P$21 12.7,26.67; P$22 11.43,26.67; P$23 10.16,26.67; P$24 8.89,26.67; P$25 7.62,26.67; P$26 6.35,26.67; P$27 5.08,26.67
SOIC_8-LEAD = smd 0.61 x 2.21: CE -1.905,-2.934; RST/HOLD -0.635,5.156; SCK 0.635,5.156; SI 1.905,5.156; SO -0.635,-2.934; VDD -1.905,5.156; VSS 1.905,-2.934; WP 0.635,-2.934
BNC-VERTICAL = drill 0.97 long: G 5.4,-7.94; S 7.92,-7.96 | drill 2.09: P$3 13.02,-2.86; P$4 2.86,-13.02
VERTICAL-JACK = drill 2 octagon: P$1 5,-1 | drill 2.2 octagon: P$2 5,-10.5
NX6035 = smd 2.5 x 3: P$1 2.665,0; P$2 -2.565,0
FH12-08S-1SH = smd 0.3 x 1.3: 1 -3.5,3.25; 2 -2.5,3.25; 3 -1.5,3.25; 4 -0.5,3.25; 5 0.5,3.25; 6 1.5,3.25; 7 2.5,3.25; 8 3.5,3.25
32005-201 = smd 3.1 x 0.5: 1 3,1.6; 2 3,0.8; 3 3,0; 4 3,-0.8; 5 3,-1.6 | smd 2.5 x 2: M1 -3,-4.45; M2 -3,4.45 | smd 3.3 x 2: M3 2.9,4.45; M4 2.9,-4.45 | hole 0.9: 0,2.2; 0,-2.2

### Placement (x,y rotation side)
3V3  62.86,83.14 180 top
8.2K  45.92,73.41 0 top
12V  72.67,16.06 0 top
20K  47.88,75.77 0 top
32U4  26.31,58.81 270 top
100K  100k  [R0805']  93.29,72.16 90 top
868MHZ  84.99,85.3 270 bottom
B1  58.53,54.12 270 top
BJ1  48.97,71.71 90 top
BKLD  35.29,50.7 270 top
C1  41.55,80.92 180 bottom
C2  30.31,8.52 90 bottom
C3  82.44,65.31 270 top
C4  90.48,68.84 90 top
C5  77.11,66.84 270 top
C6  55.23,72.58 270 top
C7  37.55,74.88 180 top
C8  36.76,72.63 0 top
C9  88.01,43.97 270 bottom
C10  34.4,64.71 90 top
C11  13.17,67.04 180 top
C12  14.68,62.93 90 top
C13  26.94,72.87 270 top
C14  81.35,24 270 bottom
C15  88.3,30.28 315 bottom
C16  56.87,48.79 135 top
C17  84.97,39.89 90 bottom
C18  63.67,52.25 270 top
C19  79.53,51.41 0 bottom
C20  79.96,45.93 0 top
C21  76.58,58.33 180 top
C22  76.66,52.12 0 top
C23  80.7,55.85 90 top
C24  74.97,36.25 0 bottom
C25  1nF  [0805']  1.52,-76.14 0 top  (outside the outline)
C26  1nF  [0805']  4.4,-76.14 0 top  (outside the outline)
C27  100nF  [0805']  7.27,-76.14 0 top  (outside the outline)
C28  100nF  [0805']  10.15,-76.14 0 top  (outside the outline)
C29  220nF  [0805']  13.02,-76.14 0 top  (outside the outline)
C30  13.02,-82.37 0 top  (outside the outline)
C31  100nF  [0805']  15.9,-76.14 0 top  (outside the outline)
C32  100nF  [0805']  18.77,-76.14 0 top  (outside the outline)
C33  100nF  [0805']  21.65,-76.14 0 top  (outside the outline)
C34  220nF  [0805']  24.52,-76.14 0 top  (outside the outline)
C35  220nF  [0805']  1.52,-79.41 0 top  (outside the outline)
C36  1nF  [0805']  12.8,-43.88 0 top  (outside the outline)
C37  1nF  [0805']  15.62,-43.88 0 top  (outside the outline)
C38  100nF  [0805']  18.44,-43.88 0 top  (outside the outline)
C39  100nF  [0805']  21.26,-43.88 0 top  (outside the outline)
C40  220nF  [0805']  24.08,-43.88 0 top  (outside the outline)
C41  26.9,-43.88 0 top  (outside the outline)
C42  100nF  [0805']  29.72,-43.88 0 top  (outside the outline)
C43  100nF  [0805']  32.54,-43.88 0 top  (outside the outline)
C44  100nF  [0805']  35.36,-43.88 0 top  (outside the outline)
C45  220nF  [0805']  1.52,-46.4 0 top  (outside the outline)
C46  220nF  [0805']  4.34,-46.4 0 top  (outside the outline)
C47  17.81,38.56 0 top
C48  57.33,32.07 0 top
CON1  38.16,-2.34 0 top
CON_ISP  34.21,74.71 90 bottom
CU1  53.03,72.61 270 top
CU2  42.62,74.94 270 top
CU3  42.39,78.74 180 bottom
CU4  28.02,8.51 90 bottom
CU7  16.97,4.98 0 bottom
CU8  10.89,5.02 180 bottom
CU9  80.71,13.51 0 top
CX1  6.6,54.38 90 top
CX2  6.6,63.42 270 top
D1  26.12,4.95 0 bottom
D2  37.87,73.81 180 bottom
D3  70.15,52.97 270 bottom
D4  55.96,15.95 0 bottom
D5  67.46,52.95 90 bottom
GND  69.65,16.06 0 top
IC1  12.47,11.02 0 bottom
IC2  75.28,25.99 270 bottom
IC3  77.57,42.54 270 bottom
IC4  19.14,26.84 270 top
IC5  76.72,55.12 90 top
IC6  46.43,31.18 90 top
J1  71.38,3.61 0 top
J2  54.19,3.66 0 top
JP1  29.07,27.3 90 top
JP3  38.85,31.43 90 top
LDMEM  66.07,68.98 90 top
LDPW3  15.46,7.96 270 top
LDPW12  15.53,10.46 270 top
LDSLAVE  10.83,77.12 0 top
LORA_RST  93.29,82.22 0 top
R1  1k  [R0805']  15.17,70.23 315 top
R2  10k  [R0805']  31.05,50.72 0 top
R3  1k  [R0805']  61.45,63.37 225 top
R4  58.58,43.71 180 top
R5  54.26,43.67 0 top
R6  82.26,32.18 90 bottom
R7  83.27,45.09 0 bottom
R8  83.42,29.09 0 bottom
R9  53.45,48.52 135 top
R10  79.26,47.89 180 bottom
R11  85.63,44.19 270 bottom
R12  1k  [R0805']  10.78,10.48 180 top
R13  81.83,49.47 0 bottom
R14  10.73,8.01 0 top
R15  77.58,49.5 0 bottom
R16  65.42,48.04 0 bottom
R17  63.73,48.86 180 top
R18  79.04,37.13 180 bottom
R19  97.3,12.66 90 bottom
R20  71.79,42.87 180 bottom
R21  72.11,39.99 0 bottom
R22  65.5,47.07 0 top
R23  65.59,53.2 90 top
R24  64.3,55.53 0 top
R25  47K  [0805']  4.4,-79.41 0 top  (outside the outline)
R26  11.24,20.94 0 top
R27  47K  [0805']  7.27,-79.41 0 top  (outside the outline)
R28  0R  [0805']  10.15,-79.41 0 top  (outside the outline)
R29  3k3  [0805']  13.02,-79.41 0 top  (outside the outline)
R30  10k  [0805']  15.9,-79.41 0 top  (outside the outline)
R31  10k  [0805']  18.77,-79.41 0 top  (outside the outline)
R32  10k  [0805']  21.65,-79.41 0 top  (outside the outline)
R33  10k  [0805']  24.52,-79.41 0 top  (outside the outline)
R34  10k  [0805']  1.52,-82.69 0 top  (outside the outline)
R35  10k  [0805']  4.4,-82.69 0 top  (outside the outline)
R36  10k  [0805']  7.27,-82.69 0 top  (outside the outline)
R37  4K7  [0805']  10.15,-82.69 0 top  (outside the outline)
R38  10.83,28.62 0 top
R39  3k3  [0805']  4.34,-48.92 0 top  (outside the outline)
R40  47K  [0805']  7.16,-48.92 0 top  (outside the outline)
R41  47K  [0805']  9.98,-48.92 0 top  (outside the outline)
R42  0R  [0805']  12.8,-48.92 0 top  (outside the outline)
R43  10k  [0805']  15.62,-48.92 0 top  (outside the outline)
R44  10k  [0805']  18.44,-48.92 0 top  (outside the outline)
R45  10k  [0805']  21.26,-48.92 0 top  (outside the outline)
R46  47.37,38.76 0 top
R47  10k  [0805']  24.08,-48.92 0 top  (outside the outline)
R48  10k  [0805']  26.9,-48.92 0 top  (outside the outline)
R49  10k  [0805']  29.72,-48.92 0 top  (outside the outline)
R50  10k  [0805']  32.54,-48.92 0 top  (outside the outline)
R51  4K7  [0805']  35.36,-48.92 0 top  (outside the outline)
R52  53.24,23 0 top
RK1  13.82,51.55 90 top
RK2  11.6,51.56 90 top
RK3  10k  [R0805']  73.68,79.73 0 top
RK4  10k  [R0805']  74.69,71.5 270 top
RK5  50.36,61.81 0 top
RK6  9.84,71.86 180 top
RK7  34.54,52.98 180 top
RK15  10k  [R0805']  20.47,46.49 0 top
RK16  10k  [R0805']  23.25,73.15 315 top
RK18  10k  [R0805']  8.76,77.06 270 top
RK19  10k  [R0805']  66.17,70.89 0 top
RUSB1  85.33,15.2 270 top
RUSB2  88.65,15.23 270 top
RXLD  24.88,68.93 180 top
RXLD1  19.48,51.18 0 top
RXT  1M  [R0805']  8.68,58.89 270 top
SJ1  10.59,69.5 0 top
SJ2  29.39,69.93 0 top
SJ3  53.22,66.61 0 top
SJ4  73.23,58.93 180 bottom
SJ5  18.26,-70.41 0 top  (outside the outline)
SJ6  73.3,56.57 180 bottom
SJ7  22.7,-70.41 0 top  (outside the outline)
SJ8  6.6,-41.74 0 top  (outside the outline)
SJ9  11.04,-41.74 0 top  (outside the outline)
TP5  75.41,49.48 0 bottom
U1  46.22,66.61 180 top
U100  93.33,52.5 0 bottom
U$1  69.37,64.79 270 top
U$2  83.33,19.89 90 top
U$3  92.29,18.58 0 top
U$5  83.32,36.02 90 top
X2  11.43,58.99 90 top
X3  17.75,82.33 180 top
X4  85.94,5.98 90 top

### Tracks (layer width: path | path; a pad name or v marks a point on that pad's centre or on a via)
3.3V  (via drill 0.8, 0.8 pad 0.81, 0.9 pad 0.61)  (16 unrouted)
  Top 0.406: 20.53,61.21 32U4.14 | v91.4,34.15 91.4,34.51 89.7,36.21 84.75,36.21 81.58,33.03 v77.91,33.03 77.91,33.47 79.27,34.83 79.27,42.08 | v82.74,41.96 79.39,41.96 79.27,42.08 | 81.79,50.4 83.48,50.4 84.45,51.37 87.17,51.37 89.6,48.94 92.58,48.94 93.6,49.96 93.6,67.35 v93.3,67.65 93.4,67.55 | IC5.2 80.03,55.12 C23.1 80.7,51.49 81.79,50.4 | RK15.1 15.91,46.49 14.04,48.36 14.04,50.38 RK1.1 | R14.1 7.58,8.01 v6.76,8.83 | 81.79,50.4 80.26,50.4 79.03,49.17 79.03,45.96 C20.1 79.06,42.29 79.27,42.08 | C5.2 76.65,65.42 U$1.RST/HOLD
  Top 0.5: 32U4.14 17.8,61.21 C12.2 | 24.93,57.06 23.11,55.24 32U4.24 | 24.93,57.06 24.93,60.39 23.44,61.88 22.81,61.88 | 22.81,61.88 22.3,61.88 21.58,61.21 20.53,61.21 | 32U4.34 27.18,54.81 24.93,57.06 | 32U4.44 29.83,62.81 29.52,63.12 | 32U4.2 29.52,63.12 | 29.52,63.12 29.52,63.02 27.7,61.2 27.7,59.89 v27.52,59.71 | 23.81,62.88 22.81,61.88
  Top 0.61: U$1.WP 68.97,64.15 v69.52,64.7 | U$1.VDD 71.51,66.69 70.46,65.64 | 70.46,65.64 v69.52,64.7 | U$1.RST/HOLD 70.24,65.42 v69.52,64.7 | RK4.2 73.53,70.55 70.46,67.48 70.46,65.64 | 91.65,67.65 90.69,67.65 arc90 C4.1 89.66,67.44 77.32,79.78 v77.32,83.43 | 91.65,67.65 v93.3,67.65 | 93.32,69.32 93.29,69.29 | 93.29,69.29 91.65,67.65 | 100K.1 93.29,69.29 | v23.81,62.78 23.81,62.88 | 56.11,67.62 54.32,69.41 U1.1 51.36,70.1 51.36,72.05 50.75,72.66 | 56.11,67.62 56.11,64.29 54.59,62.76 52.26,62.76 51.7,62.26 | RK6.2 6.7,71.86 v6.7,71.55 | v6.7,67.84 9.32,65.22 12.38,65.22 13.72,63.88 C12.2 | RK18.1 6.7,78.01 v6.7,78.15 | RK1.1 13.81,50.61 RK2.1 7.11,50.61 v6.7,50.21 6.76,50.14 | 51.7,62.26 RK5.2 | 50.75,72.66 BJ1.2 | RK16.1 22.58,77.06 v28.66,83.14 | v80.74,68.48 82.44,68.48 C3.1 | 50.75,72.66 51.65,73.56 CU1.1 55.2,73.56 C6.1 | U1.16 50.66,63.29 51.7,62.26 | 56.11,67.62 58.51,70.01 61.58,70.01 v64.68,73.11 65.22,72.57 RK19.1
  Bottom 0.203: 3V3.1 62.91,83.22 62.77,83.14
  Bottom 0.406: IC2.4 79.76,25.99 C14.1 | 77.86,26 IC2.4 | R6.2 v77.91,33.03 76.42,33.03 74.91,31.53 74.91,27.19 76.08,26.02 77.85,26.02 IC2.4 | v82.74,41.96 82.16,42.54 IC3.4 | v91.4,34.15 98.53,27.03 98.53,18.6 97.5,17.58 U$3.P$1 | v80.74,68.48 80.2,67.94 75.75,67.94 U100.P$12 | 27.57,59.65 v27.52,59.71
  Bottom 0.5: v27.52,59.71 27.11,59.71 v23.81,62.78
  Bottom 0.61: v69.52,64.7 69.52,72.48 64.59,77.41 | U100.P$12 75.06,68.34 72.65,70.76 72.65,78.99 75.61,81.95 75.61,83.06 | 75.61,83.06 75.1,83.57 63.2,83.57 62.77,83.14 | 64.59,77.41 64.59,82.9 64.36,83.14 | v80.74,68.48 80.86,68.34 | v93.3,67.65 arc90 93.33,67.67 U100.P$34 | 75.61,83.06 76.95,83.06 v77.32,83.43 | 64.59,73.63 64.59,73.19 v64.68,73.11 64.68,73.54 64.59,73.63 | 64.59,73.63 64.59,77.41
  Bottom 1.27: v6.7,50.21 v6.7,67.84 v6.7,71.55 v6.7,78.15 6.7,83.14 v28.66,83.14 | 6.76,50.14 v6.76,8.83 6.76,6.73 8.47,5.02 CU8.1 10.16,5.24 IC1.3
  Bottom 1.676: v28.66,83.14 62.77,83.14 64.36,83.14 64.55,83.14 64.55,83.15 | 6.76,50.14 v6.7,50.21
+12V  (10 unrouted)
  Top 0.406: CON1.P$1 37.3,12.22 10.71,12.22 9.83,11.33 R12.2
  Bottom 0.406: 12V.1 arc-90 72.06,15.99 72.06,13.58
  Bottom 0.61: 50.7,14.19 50.18,13.67 | C2.1 CU4.1 27.62,7.16 D1.A
  Bottom 1.676: 56.74,13.67 50.18,13.67 39.77,13.67 38.16,12.05 CON1.P$1 31.78,4.98 27.64,4.98 D1.A | 56.74,13.67 71.98,13.67 72.06,13.58 73.93,11.72 J1.+12V | J2.+12V 56.73,13.65 56.74,13.67
-3V3  (via drill 0.8)
  Top 0.406: IC5.1 78.02,52.16 C22.2 78.06,50.76 76.97,49.66 76.97,42.63 v77.04,42.56
  Bottom 0.406: IC3.11 77.03,42.54 v77.04,42.56
A1
  Top 0.406: LORA_RST.1 100K.2 94.51,73.11 95.28,72.34 | 95.28,72.34 95.29,72.34 | 95.28,72.34 95.28,42.42 94.13,41.87 94.2,29.73 94.2,19.85 95.25,18.8 95.25,17.5 92.99,15.24 83.73,15.24 82.1,16.88 74.69,16.88 73.42,18.15 67.64,18.15 66.9,18.89 66.9,33.24 64.8,35.34 64.8,38.27 62.53,40.55 52.21,40.55 50.3,42.45 50.3,47.45 47.62,50.14 47.62,51.16 41.82,56.97 40.54,56.97 39.5,58.01 34.78,58.01 33.92,57.15 32.17,57.15 32U4.37
  Top 0.61: LORA_RST.1
  Bottom 0.406: 93.93,73.42 95.19,74.68 95.19,80.33 LORA_RST.1
  Bottom 0.61: U100.P$32 93.93,73.42
A3  (via drill 0.8)
  Top 0.406: 32U4.39 41.01,58.81 v41.32,58.5
  Top 0.61: v53.91,61.59 59.67,61.59 R3.2 59.58,63.89 59.58,65.4 63.16,68.98 LDMEM.C
  Bottom 0.61: v53.91,61.59 52.33,63.17 45.59,63.17 41.83,59.41 41.83,59.01 v41.32,58.5
A4  (via drill 0.8)
  Top 0.406: v92.57,20.21 93.42,21.05 93.42,28.87 92.76,29.53 83.39,29.53 81.75,31.17 77.01,31.17 74.2,33.98 74.2,49.52 73.39,50.33 73.39,52.14 67.38,58.52 60.51,58.52 59.55,57.19 55.56,57.19 54.94,56.56 v50.25,56.56 | v46.45,54.65 41.49,59.61 32U4.40
  Bottom 0.406: U$3.P$2 R19.1 93.74,11.81 92.65,12.9 92.65,20.14 v92.57,20.21 | v50.25,56.56 48.33,54.65 v46.45,54.65
A5
  Top 0.406: 32U4.41 34.58,60.41 36.11,61.94 36.11,62.5 38.84,65.22 44.17,65.22 44.31,65.07 U1.11
A+  (via drill 0.8)
  Top 0.406: v39.44,68.78 41.15,68.78 U1.8 | R24.1 63.4,56.91 v63.75,57.26 63.85,57.36 65.62,57.36 72.49,50.49 v72.49,46.6
  Bottom 0.406: v63.75,57.26 63.73,59.18 55.12,67.79 40.43,67.79 v39.44,68.78 | IC3.14 72.73,46.35 v72.49,46.6
ANGND  (via drill 0.6, 0.8)
  Top 0.61: C3.2 82.5,63.85 v82.5,62.15 | C4.2 arc90 90.49,70.25 v90.49,72.16
  Bottom 0.406: SJ6.2 75,56.57 75.26,56.83 | SJ4.2 73.79,58.87 74.62,58.87
  Bottom 0.61: v82.5,62.15 81.71,61.37 | v90.49,72.16 arc-90 90.41,72.23 | 90.41,72.23
  other vias: 82.76,83.71 78.46,80.43 78.43,81.64 78.71,83.69 91.5,83.76 91.53,82.28
  pour Bottom (rank 2): 73.82,85.13 95.5,85.13 95.44,53.22 73.64,53.22 73.73,84.51
  pour Top: 78.01,84.86 92.23,84.77 92.23,78.78 77.68,78.78 77.64,84.71 77.68,84.86 77.86,84.89
ANT868
  Bottom 0.61: U100.P$23 83.17,81.84 868MHZ.P
AREF
  Top 0.406: 32U4.42 33.93,61.21 33.94,61.2 34.4,61.65 C10.1
B+
  Top 0.406: U1.10 43.04,61.02 50.06,54 50.06,51.09 52.03,49.12 R9.2 53.51,49.78 55.88,49.78 C16.2
B-  (via drill 0.6, 0.8)
  Top 0.406: v66.66,36.07 66.65,38.07 62.93,41.85 52.24,41.85 51.18,42.91 51.18,48.28 48.7,50.76 48.68,54.02 41.75,60.94 U1.9 | v70.63,32.88 70.15,32.4 70.15,21.24 70.66,20.73 80.09,20.73 84.64,25.29 86.7,25.29 | U$2.G 89.26,25.29 86.7,25.29 | v84.72,27.26 86.7,25.29
  Bottom 0.406: v66.66,36.07 68.2,36.05 70.63,33.62 v70.63,32.88 | IC2.3 80.04,27.26 | 80.04,27.26 v84.72,27.26 | IC2.1 79.79,29.8 80.1,29.5 80.1,27.32 80.04,27.26
CN3
  Top 0.61: 44.35,69.44 U1.6 44.33,69.43 44.33,71.63 44.06,71.91 41.23,71.91 40.5,72.63 C8.2
CS_32U4
  Top 0.61: 13.87,76.11 15.37,76.09 16.25,76.97 X3.6 | LDSLAVE.C 12.5,78.17 13.16,77.51 13.16,76.83 13.87,76.11 | R1.1 14.64,71.76 15.41,72.53 15.41,74.58 13.87,76.11
D5*  (1 unrouted)
  Top 0.406: 32U4.31 28.71,47.08 29.54,46.26 36.16,46.26 37.56,47.66 42.5,47.66 43.76,46.4
D7*
  Top 0.406: 32U4.1 30.32,65.93 31.91,67.53 36.24,67.53 37.83,65.94 45.3,65.94 45.58,65.66 U1.12
D8*  (1 unrouted)
  Top 0.406: 32U4.28 26.32,46.08 25.25,45.01 25.25,38.22 25.12,38.09
D9*  (1 unrouted)
  Top 0.406: 32U4.29 27.11,45.42 26.32,44.62 26.32,40.16 26.75,39.73
D10*  (1 unrouted)
  Top 0.406: 32U4.30 27.91,46.12 28.88,45.15 36.52,45.15 37.95,46.58 41.78,46.58 42.54,45.83 42.54,38.88 42.75,38.67
D11*
  Top 0.406: 32U4.12 19.71,62.81 17.4,65.12 17.4,66.25 16.43,67.22 16.43,69.06 R1.2
D12*
  Top 0.406: 32U4.26
D13*
  Top 0.406: 32U4.32 29.5,53 29.5,51.64 30.1,51.05
  Top 0.61: 30.1,51.05 R2.1
GND  (via drill 0.8, 0.8 pad 0.41, 0.8 pad 0.81, 0.9, 0.9 pad 0.61, 0.9 pad 0.81)  (47 unrouted)
  Top 0.406: 22.43,60.39 32U4.15 15.8,60.41 C12.1 | 32U4.5 27.11,62.88 v27.12,62.26 | 32U4.23 22.32,51.91 v21.51,51.1 | 32U4.35 35.12,55.61 v36.52,56.62 | 32U4.43 29.86,62.01 v29.63,61.45 | X4.5 87.54,10.7 v90.85,11.85 | CU9.1 arc90 79.2,13.4 v79.2,11.07 | 55.2,71.21 55.32,71.32 | 55.32,71.32 57.05,71.32 57.07,71.31 v57.38,71.31 | CU1.2 53.14,71.32 55.32,71.32 | R5.1 53.41,45.15 v52.71,45.85 | C16.1 59.24,46.43 v59.24,45.8 | C20.2 81.97,45.93 v83.66,47.83 | IC5.4 72.4,56.07 | 72.4,56.07 72.27,56.07 v70.52,57.82 | C23.2 84.96,57.25 v90.9,51.31 | C22.1 72.4,54.98 72.4,56.07 | LDPW3.C 19.7,7.96 v19.9,7.76 | LDPW12.C 19.71,10.46 v19.9,10.27
  Top 0.61: 22.43,60.39 v22.5,60.42 | CX2.1 7.96,63.86 v10.82,63.83 | v9.74,52.3 7.28,52.3 CX1.1 | BKLD.C 36.43,50.61 v37.71,50.61 | SJ3.2 53.98,65.26 v53.09,64.36 | RK7.1 35.76,52.98 v37.48,52.97 | SJ2.1 28.88,68.8 v27.83,68.21 | X3.7 X3.8 13.11,79.08 v12.29,79.89 | SJ1.1 9.78,69.45 v9.78,66.93 | C13.1 26.94,77.09 v26.78,77.26 | U1.14 48.12,60.46 v47.74,60.08 | U$1.VSS 66.36,62.96 64.03,62.96 v63.33,62.26 | C10.2 32.84,65.66 v32.15,64.98
  Top 0.813: C11.2 11.62,66.94 v9.78,66.93 | C5.1 76.41,68.49 v73.11,68.49
  Bottom 0.406: v27.12,62.26 27.18,62.82 | 90.9,52.26 v90.9,51.31 | v90.9,51.31 90.9,50.68 | v90.85,11.85 88.33,12.67 88.63,12.67 | v79.2,11.07 arc90 78.71,10.57 78.71,10.18 | v19.9,7.76 18.99,8.95 | v57.38,71.31 57.56,71.13 | v52.71,45.85 52.71,46.05 52.93,46.27 | v59.24,45.8 59.67,46.24 59.99,46.24 | R11.1 85.69,45.09 | 86.67,44.12 86.68,44.12 86.79,44 88.88,44 88.89,44.02 | 70.95,58.62 70.82,58.48 | 70.82,58.48 70.66,58.32 | 90.98,47.22 90.98,47.36 91.3,47.67 | v83.66,47.83 84.38,47.61 82.93,47.61 | SJ4.1 72.28,58.48 70.82,58.48 | R19.2 95.96,13.51 95.44,14.03 94.26,14.03 | SJ6.1 71.74,56.57 71.69,56.52 | v70.52,57.82 70.29,57.82 70.27,57.84 | v90.9,51.31 91.57,51.31 91.69,51.19 | v19.9,10.27 19.9,10.18 20.07,10.01 | CU8.2 12.08,4.77 13.87,4.77
  Bottom 0.61: v22.5,60.42 22.9,60.41 23.23,60.07 | 14.79,77.16 14.61,76.98 | 27.18,62.82 27.6,62.4 | v9.74,52.3 9.15,52.3 | v10.82,63.83 10.62,63.85 10.48,63.98 10.22,63.59 | v21.51,51.1 21.51,50.46 21.57,50.4 | 26.93,74.48 28.03,74.48 28.17,74.63 | v36.52,56.62 35.19,54.22 34.62,54.58 | v29.63,61.45 29.3,60.44 29.71,60.49 | v37.71,50.61 38.15,50 38.15,49.62 | v53.09,64.36 53.09,63.45 53.23,63.3 53.23,63.32 | v37.48,52.97 37.35,53.46 37.32,53.15 | v12.29,79.89 12.29,80.16 12.54,80.41 | v26.78,77.26 26.21,77.26 26.16,77.32 | v73.11,68.49 72.55,67.94 72.72,67.92 | v47.74,60.08 47.32,60.08 47.13,59.89 | v63.33,62.26 | v63.33,62.26 63,61.93 | 29.3,79.38 19.77,79.38 | CU8.2 12.47,5.65 IC1.2
  Bottom 0.813: v9.78,66.93 9.74,65.66 9.85,65.69
  pour Bottom: 4.88,85 72.93,85 72.93,52.33 95.55,52.33 95.55,-0.84 4.67,-0.84 4.67,84.96
HWB
  Top 0.406: RK7.2 30.34,52.98 32U4.33
ISP+5V
  Bottom 0.61: D2.A 36.37,74.45 CON_ISP.5V
LGND
  Top 0.406: SJ2.2 32.59,72.63 C8.1
  Top 0.61: U1.5 45.58,72.79 8.2K.1 | 44.84,73.54 8.2K.1 | C7.2 35.78,74.16 C8.1 | CU2.2 43.2,73.41 8.2K.1
  pour Top: 56.91,77.59 40.54,77.59 35.69,72.73 35.69,62.38 37.39,60.67 60.36,60.67 63.17,63.49 63.17,74.86 60.66,77.37 58.22,77.35 57.89,77.55 57.34,77.53 57.14,77.55 56.95,77.55
MISO  (via drill 0.8 pad 0.81, 0.9 pad 0.61)
  Top 0.406: v30.25,74.51 33.5,77.66 37.98,77.66 39.89,79.67 52.27,79.67 52.28,79.66 59.02,79.68 61.32,77.37 61.33,77.36 77.72,77.36 78.11,76.97 78.11,74.77 77.51,74.17 73.62,74.17 72.91,73.46 72.91,71.14 71.1,69.32 69.44,69.32 68.94,68.82 68.94,66.51 67.85,65.42 U$1.SO | 32U4.11 20.97,64.61 v17.8,67.78 17.8,70.06 17.25,70.61 X3.5
  Bottom 0.406: 28.25,73.26 21,73.26 17.8,70.06 v17.8,67.78 | 28.25,73.26 30.85,73.26 CON_ISP.MISO | v30.25,74.51 29.5,74.51 28.25,73.26
MOSI  (via drill 0.8, 0.8 pad 0.81, 0.9 pad 0.61)
  Top 0.406: 32U4.10 23.11,65.8 22.31,66.6 21.25,66.6 19.12,68.73 19.12,69.78 | 19.12,69.78 19.12,70.86 18.25,71.73 X3.4 | 20.11,70.78 19.12,69.78
  Top 0.61: v29.68,72 34.31,76.62 38.16,76.62 40.41,78.78 53.06,78.78 53.22,78.78 58.59,78.76 61.35,76.1 68.95,76.1 69.73,75.32 75.64,75.32 v76.41,76.09 | v20.42,70.78 20.11,70.78 | U$1.SI 77.67,62.88 79.28,64.49 79.28,70.92 v77.86,72.35 77.66,72.54 74.78,72.54 RK4.1
  Bottom 0.61: CON_ISP.MOSI 36.83,77.25 37.92,76.16 37.92,72.48 36.13,70.69 28.29,70.69 | 28.29,70.69 23.57,70.69 22.33,71.93 21.58,71.93 v20.42,70.78 | v29.68,72 29.6,72 28.29,70.69 | v76.41,76.09 76.41,73.8 v77.86,72.35
N$1
  Top 0.406: 32U4.6 26.32,68.62 27.1,69.4 27.1,71.32
  Top 0.61: 27.1,71.32 C13.2
N$2  (1 unrouted)
N$3
  Top 0.61: BKLD.A 34.22,50.72 R2.2
N$4  (1 unrouted)
N$5
  Top 0.61: U1.3 48.12,71.43 BJ1.3 48.19,71.71 48.6,72.13 48.6,74.2 48.99,74.59 48.99,75.24 | 48.99,75.24 48.99,75.61 20K.2 | 48.99,75.24 49.07,75.32 49.07,76.95 48.73,77.29 45.62,77.29 44.21,75.89 CU2.1 41.99,76.96 40.19,76.96 38.95,75.72 C7.1
N$6  (1 unrouted)
N$7
  Top 0.406: LDPW12.A 11.74,10.46 R12.1
N$8  (1 unrouted)
N$9  (1 unrouted)
N$10
  Top 0.61: U$1.CE 64.78,66.69 R3.1
N$11  (1 unrouted)
N$12  (2 unrouted)
N$13  (2 unrouted)
N$14  (3 unrouted)
N$15  (2 unrouted)
N$16  (2 unrouted)
N$17
  Top 0.406: R9.1 55.11,46.87 R5.2 55.16,43.71 R4.2
N$18
  Bottom 0.406: R7.2 82.36,45.08 IC3.2 78.91,45.08 78.36,45.62 R10.1 77.74,47.89 77.19,48.44 72.78,48.44 D3.A 70.13,51.05 D5.C
N$19  (1 unrouted)
N$20
  Bottom 0.406: R13.1 82.86,49.6 82.86,50.06 83.94,51.14 87.21,51.14 88.19,50.09 88.19,50.06 88.68,49.57 88.68,46.04 C9.1
N$21
  Bottom 0.406: IC2.5 79.21,24.73 80.04,23.9 85.85,23.9 89.75,27.8 91.28,27.8 U$2.S
N$22
  Top 0.61: LDSLAVE.A 8.8,76.07 RK18.2
N$23  (via drill 0.8)
  Top 0.61: U$1.SCK 72.56,64.15 v71.61,63.75 | RK3.2 74.87,80.24 73.1,81.87 v72.4,81.85
  Bottom 0.61: v71.61,63.75 71.63,64.04 71.57,81.22 v72.4,81.85
N$24
  Top 0.61: RXLD.A 24.88,71.52 RK16.2
N$25
  Top 0.61: RK19.2 LDMEM.A
N$26
  Bottom 0.406: R15.1 R13.2 | R13.2 80.93,48.66 R10.2 80.16,46.37 IC3.1 | R13.2 80.93,50.91 C19.1
N$27
  Bottom 0.406: IC2.2 76.23,28.53 76.13,28.64 76.13,30.65 76.81,31.33 R6.1 | R6.1 82.26,29.39 R8.2 | C15.2 87.57,28.89 85.98,30.48 85.23,30.48 84.6,31.11 82.49,31.11 R6.1
N$28  (via drill 0.8)
  Top 0.406: v75.26,23.04 75.26,30.9 71.19,34.97 71.19,39.08 70.1,40.16 66.7,40.16 63.15,43.71 R4.1
  Bottom 0.406: IC2.6 IC2.7 76.12,22.18 v75.26,23.04
N$29
  Bottom 0.406: R15.2 75.42,49.5 | 75.42,49.5 TP5.P$1 | 80.16,41.26 IC3.5 80.13,41.22 78.82,41.22 78.23,41.81 78.23,43.68 77.16,44.75 77.16,47.31 76.86,47.7 68.07,47.7 | 75.42,49.5 73.72,49.5 71.57,51.64 71.57,52.72 71.32,52.97 66.48,52.97 65.81,52.3 65.81,49.97 68.07,47.7 | R16.1 66.21,47.7 68.07,47.7
N$30
  Bottom 0.406: R11.2 84.97,42.37 C17.2 | IC3.3 85.1,43.81 R11.2 | R11.2 87.82,43.29 C9.2
N$31  (1 unrouted)
N$32  (3 unrouted)
N$33  (1 unrouted)
N$34
  Top 0.406: R14.2 14.37,8.01 LDPW3.A
N$35  (via drill 0.8)
  Top 0.406: U$5.S 90.99,44.24 90.17,44.24 v82.34,36.4
  Bottom 0.406: R18.1 78.01,37.26 78.01,39.85 78.16,40 IC3.6 80.19,40.01 81.77,40.01 82.34,39.44 v82.34,36.4
N$36
  Bottom 0.406: IC3.7 80.17,37.37 R18.2 80.02,37.05 80.02,36.14 79.56,35.68 79.55,35.7 77.57,35.7 77.02,36.25 C24.1
N$37  (2 unrouted)
N$38
  Top 0.61: U1.2 49.39,70.21 BJ1.1
N$39  (1 unrouted)
  Top 0.61: U1.4 46.85,70.87 8.2K.2 | 46.87,75.71 20K.1
N$40
  Bottom 0.406: C24.2 73.57,37.07 74.27,37.76 76.89,37.76 77.02,37.9 77.02,41.11 76.86,41.27 IC3.10 | IC3.10 | R20.2 73.25,42.3 73.25,41.7 73.68,41.27 IC3.10
N$41
  Top 0.61: SJ3.1 50.6,66.61 49.39,65.4 U1.15 49.41,63.79 49.41,61.91 RK5.1
N$42
  Top 0.406: 32U4.17 13.82,58.81 X2.P$2
  Top 0.61: RXT.2 9.92,57.94 X2.P$2 11.49,56.37 12.04,56.37 11,55.33 CX1.2
N$43  (via drill 0.8)
  Top 0.406: v72.64,38.24 72.59,38.24 72.34,38.49 72.34,40.2 71.67,40.87 67.44,40.87 B1.~2
  Bottom 0.406: IC3.8 73.13,38.73 v72.64,38.24
N$44
  Bottom 0.406: C19.2 73.31,51.41 72.49,52.23 72.49,54.61 72.26,54.83 70.88,54.83 D3.C 68.31,54.89 D5.A
N$45
  Top 0.406: C21.1 77.97,56.11 IC5.3
N$46
  Top 0.406: C21.2 75.52,58.33 76.78,57.07 76.78,54.49 76.56,54.27 75.53,54.27 IC5.5
N$47
  Top 0.406: B1.- 61.58,54.55 61.97,54.16 63.17,54.16 63.67,53.65 C18.1 63.69,53.16 64.56,53.16 65.42,52.3 R23.1 65.58,49.64 64.8,48.85 R17.1
N$48  (via drill 0.8)
  Top 0.406: v68.23,42.2 67.66,42.2 57.38,52.48 57.38,54.58 56.61,55.35 55.55,55.35 B1.~1
  Bottom 0.406: IC3.9 73.02,40 R21.1 73.01,40.45 71.65,41.81 68.62,41.81 v68.23,42.2
N$49
  Top 0.406: B1.+ 63.05,51.35 | R22.1 62.83,48.83 R17.2 62.83,51.13 63.05,51.35 | C18.2 63.05,51.35
N$50  (via drill 0.8)
  Top 0.406: R22.2 68.99,44.48 v69.64,44.48
  Bottom 0.406: v69.64,44.48 70.88,44.48 71.29,44.07 74.72,44.07 arc-90 IC3.12
N$51  (via drill 0.8)
  Top 0.406: R24.2 65.59,55.15 R23.2 66.95,54.1 70.6,50.46 v70.6,46.2
  Bottom 0.406: IC3.13 71.72,45.08 v70.6,46.2
N$52
  Top 0.406: RXLD1.A 19.6,50.13 21.37,48.36 21.37,46.54 RK15.2
N$53  (2 unrouted)
N$54  (1 unrouted)
N$55  (1 unrouted)
N$56  (1 unrouted)
N$73  (1 unrouted)
N$74  (1 unrouted)
N$75  (1 unrouted)
N$76  (1 unrouted)
N$77  (1 unrouted)
N$78  (1 unrouted)
N$79  (2 unrouted)
N$80  (2 unrouted)
N$81  (3 unrouted)
N$82  (2 unrouted)
N$83  (2 unrouted)
N$84  (1 unrouted)
N$85  (1 unrouted)
N$86  (3 unrouted)
N$87  (1 unrouted)
N$88  (2 unrouted)
N$89  (2 unrouted)
N$90  (1 unrouted)
N$95  (1 unrouted)
N$96  (1 unrouted)
RESET  (via drill 0.8 pad 0.81)
  Top 0.406: 32U4.13 19.05,62.01 16.43,64.63 16.43,65.75 15.13,67.05
  Top 0.61: 14.69,66.92 C11.1 | C11.1 14.56,67.05 14.56,68.25 13.38,69.43 11.43,69.43 SJ1.2 11.35,71.86 RK6.1 12.49,71.86 v13.67,73.01 | 15.13,67.05 14.58,67.05 C11.1
  Bottom 0.61: CON_ISP.RESET 19.15,78.52 v13.67,73.01
RX  (via drill 0.8, 0.9 pad 0.61)
  Top 0.406: 32U4.20 20.48,56.38 17.04,56.38 16.48,55.82 16.48,53.58 15.88,52.98 v15.88,49.61 | v53.68,58.07 57.93,58.07 59.47,59.62 66.34,59.62 v66.78,60.06 | v27.8,41.81 28.49,41.79 29.48,41.8 37.65,41.8 40.73,45.03 v40.79,45.19
  Bottom 0.406: v53.68,58.07 53.08,58.68 52.09,58.68 49.33,61.44 47.16,61.44 45.21,59.49 45.2,59.49 43.41,57.71 43.41,47.57 v40.79,45.19 | v15.88,49.61 15.88,48.78 19.41,45.24 24.15,45.24 v27.8,41.81 | v66.78,60.06 67.04,60.32 75.35,60.32 U100.P$6
RXLED
  Top 0.406: 32U4.8 24.71,67.72
  Top 0.61: 24.71,67.72 RXLD.C
SCK  (via drill 0.8 pad 0.81, 0.9 pad 0.61)
  Top 0.406: 32U4.9 23.91,66.54 21.26,69.19 21.26,69.71 21.87,70.32 21.87,71.25 19.25,73.87 19.25,77.84 | X3.3 19.25,77.84 | 20.79,76.29 19.25,77.84
  Top 0.61: v20.84,76.29 20.79,76.29 | RK3.1 71.64,78.64 61.56,78.64 58.51,81.69 32.01,81.69 29.82,79.5 v29.82,77.2
  Bottom 0.61: 28.26,75.79 31.27,75.79 32.68,77.2 33.52,77.2 CON_ISP.SCK | v29.82,77.2 29.68,77.2 28.26,75.79 | 28.26,75.79 21.35,75.79 v20.84,76.29
SCL  (via drill 0.8, 0.8 pad 0.81)
  Top 0.406: RK2.2 11.6,54.08 11.8,54.29 13.07,54.29 14.37,55.59 14.37,57.11 15.27,58.01 32U4.18 20.53,58.01 21.69,58.01 22.52,58.85 v23.57,58.85 | 58.65,7.33 58.65,8.92 56.09,11.48 53.75,11.48 49.41,15.82 34.25,15.82 33.31,16.75 33.31,39.51 v32.4,40.42 | 58.65,7.33 58.65,6.97 57.4,5.72 55.96,5.72 J2.SCL | J1.SCL 72.92,6.06 71.9,7.17 58.92,7.17 58.65,7.33
  Bottom 0.406: 23.57,58.68 23.77,58.68 24.9,57.55 24.9,49.99 32.4,42.48 v32.4,40.42
  Bottom 0.61: v23.57,58.85 23.57,58.68
SDA  (via drill 0.8, 0.8 pad 0.81)
  Top 0.406: RK1.2 15.4,54.09 15.4,56.48 16.13,57.21 32U4.19 20.53,57.23 v23.03,57.23 | 38.09,14.95 39.43,14.95 | 39.43,14.95 48.23,14.95 50.3,12.88 | 50.3,12.88 J2.SDA | J1.SDA 71.88,9.5 73,10.62 75.12,10.62 76.26,9.48 76.26,6.68 74.05,4.47 71.74,4.47 68.3,1.02 51.53,1.02 50.3,2.25 50.3,12.88 | 39.43,14.95 39.42,14.96 33.48,14.96 32.38,16.07 32.38,37.62 v31.87,38.13
  Bottom 0.406: 23.07,57.23 23.07,50.49 30.56,43 30.56,39.44 v31.87,38.13
  Bottom 0.61: v23.03,57.23 23.07,57.23
TX  (via drill 0.8, 0.9 pad 0.61)
  Top 0.406: 32U4.21 20.48,55.57 17.89,55.57 17.36,55.04 v17.36,50.84 | v55.56,59.83 58.17,59.83 58.92,60.58 64.17,60.58 v65.17,61.57 | v27.76,43.93 28.26,43.93 29.65,42.54 36.08,42.54 v38.66,45.08
  Bottom 0.203: v17.36,50.84 17.34,50.91 17.34,50.83
  Bottom 0.406: v55.56,59.83 52.32,59.83 49.8,62.34 46.75,62.34 43.46,59.06 43.46,59.05 42.55,58.14 42.55,49.01 v38.66,45.08 | v65.17,61.57 75.53,61.57 U100.P$7 | 17.34,50.83 17.34,48.5 19.49,46.36 25.33,46.36 v27.76,43.93
TXLED
  Top 0.406: RXLD1.C 19.48,53.77 32U4.22
USB_N  (via drill 0.3)
  Top 0.203: RUSB1.1 85.33,16.82 85.66,17.14
  Top 0.406: v29.12,66.52 28.71,66.12 32U4.3 | 86.11,16.53 85.66,16.98 85.66,17.14 85.66,18.47 84.94,19.19 68.82,19.19 68.22,19.79 v68.22,38.29
  Bottom 0.406: v29.12,66.52 29.36,66.76 32.8,66.76 33.63,65.93 33.63,61.56 35.84,59.35 40.65,59.35 40.65,61.13 43.71,64.2 47.93,64.2 50,66.27 54.4,66.27 61.91,58.76 61.91,42.01 64.77,39.15 67.36,39.15 v68.22,38.29
USB_P  (via drill 0.3)
  Top 0.406: v27.93,66.68 27.93,64.62 32U4.4 | 88.89,16.88 RUSB2.1 88.65,17.96 86.76,19.84 69.56,19.85 69.28,20.14 v69.28,38.3
  Bottom 0.406: v27.93,66.68 28.66,67.42 33.07,67.42 34.29,66.2 34.29,61.83 36.12,60 39.99,60 39.99,61.41 43.44,64.85 47.66,64.85 49.84,67.04 54.57,67.04 62.57,59.03 62.57,42.34 64.88,40.03 68.62,40.03 69.28,39.37 v69.28,38.3
USBC_N
  Top 0.406: X4.2 85.14,13.6 RUSB1.2
USBC_P
  Top 0.406: X4.3 85.94,10.91 87.24,12.21 88.21,12.21 88.65,12.66 RUSB2.2
VDD  (via drill 0.8)  (1 unrouted)
  Top 0.406: X3.1 21.25,80.65 v20.93,80.97 20.25,80.29 X3.2
  Top 0.813: v24.63,10.59 v24.63,7.32
  Bottom 0.61: IC1.1 14.79,9.28 13.42,10.64 10.02,10.64 8.2,12.45 8.2,81.11 8.78,81.69 39.83,81.69 C1.1 40.6,79.58 CU3.1 41.44,75.88 D2.C | v20.93,80.97 21.5,81.54
  Bottom 0.813: D4.C 54.37,16.03 38.24,16.03 33.51,11.3 25.34,11.3 v24.63,10.59 | v24.63,7.32 24.63,4.97 D1.C
  Bottom 1.27: 17.95,5.01 CU7.1 | D1.C 17.95,4.96 CU7.1 | CU7.1 17.92,6.92 16.89,7.96 14.82,7.96 IC1.1
VUSB  (via drill 0.8, 0.8 pad 0.81)
  Top 0.406: 32U4.7 25.52,61.49 26.02,60.98 26.02,58.43 v28.76,56.88 | 72.44,13.57 71.87,13.57 70.59,12.29 54.31,12.29 49.88,16.73 34.91,16.73 34.2,17.44 34.2,38.77 v35.93,40.51 | CU9.2 84.34,11.28 X4.1
  Top 0.61: CU9.2 82.11,15.19 81.23,16.07 78.22,16.07 75.71,13.57 72.44,13.57 68.31,13.57 66.95,14.94 v66.95,15.92
  Bottom 0.406: v28.76,56.88 29.02,56.23 29.02,51.05 36.52,43.55 36.52,41.09 v35.93,40.51
  Bottom 0.61: v66.95,15.92 57.69,15.92 D4.A
XTAL1
  Top 0.406: 32U4.16 13.48,59.61
  Top 0.61: 13.48,59.61 X2.P$1 | X2.P$1 6.97,61.65 CX2.2 | RXT.1 9.62,59.84 X2.P$1

### Text on the board
tNames: SPI | D11 | MEM SELECT | Rx | pH V5.0 | pH V5.0 | IF LoRa | Tx | I2C P-ups / Don't solder / If Slave | BLK | OPT | pH V5.0 | 12V | 3V3
bNames: LoRa RN2483
tValues: Screen | PID
203bmp: C:/Users/G/Pictures/logo_epfl.bmp